# Altium project SMART_WATCH_TOP.PrjPcb
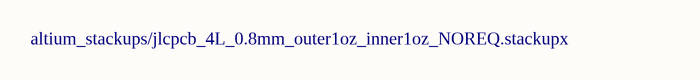
[diagram p0: specification.SchDoc]
11 sheets, 92 parts. Net scope: global (net labels, ports and power ports of the same name join across sheets).
Board file: WATCH.PcbDoc
Sheets:
  specification.SchDoc
  MAIN.SchDoc
    U_NRF24L01 = NRF24L01.SchDoc
    U_LCD = LCD.SchDoc
    U_button = button.SchDoc
    U_MPU_6050 = MPU_6050.SchDoc
    U_buzzer = buzzer.SchDoc
    U_GPIO_Expander = GPIO_Expander.SchDoc
    U_PWR = PWR.SchDoc
    U_mcu = mcu.SchDoc
    U_TOP_TO_BOTTOM_CONT = TOP_TO_BOTTOM_CONT.SchDoc

## Sheet specification.SchDoc
size A; SheetNumber: 5; SheetTotal: 5

### Notes on the sheet
- altium_stackups/jlcpcb_4L_0.8mm_outer1oz_inner1oz_NOREQ.stackupx

## Sheet MAIN.SchDoc
size A4; SheetNumber: 2; SheetTotal: 11
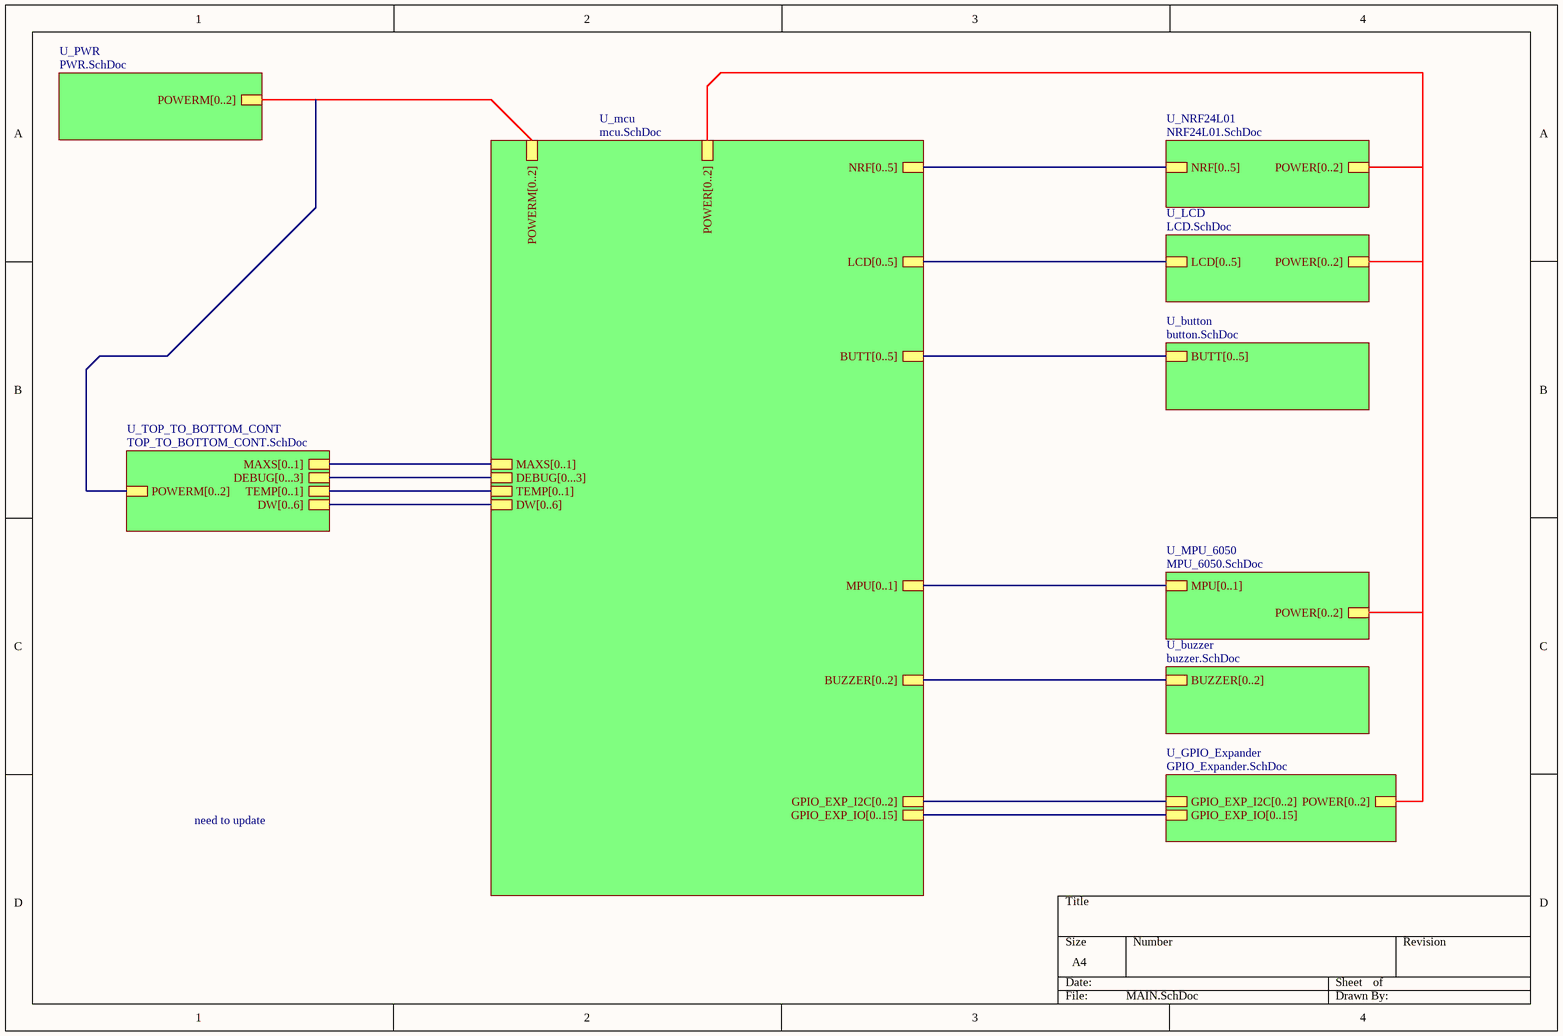
[diagram p1: MAIN.SchDoc]

### Sub-sheets
U_button = button.SchDoc: BUTT[0..5]
U_buzzer = buzzer.SchDoc: BUZZER[0..2]
U_GPIO_Expander = GPIO_Expander.SchDoc: POWER[0..2], GPIO_EXP_I2C[0..2], GPIO_EXP_IO[0..15]
U_LCD = LCD.SchDoc: POWER[0..2], LCD[0..5]
U_mcu = mcu.SchDoc: POWER[0..2], LCD[0..5], NRF[0..5], GPIO_EXP_I2C[0..2], MPU[0..1], BUZZER[0..2], GPIO_EXP_IO[0..15], BUTT[0..5], POWERM[0..2], MAXS[0..1], DEBUG[0...3], TEMP[0..1], DW[0..6]
U_MPU_6050 = MPU_6050.SchDoc: MPU[0..1], POWER[0..2]
U_NRF24L01 = NRF24L01.SchDoc: NRF[0..5], POWER[0..2]
U_PWR = PWR.SchDoc: POWERM[0..2]
U_TOP_TO_BOTTOM_CONT = TOP_TO_BOTTOM_CONT.SchDoc: MAXS[0..1], DW[0..6], TEMP[0..1], DEBUG[0...3], POWERM[0..2]

### Buses and harness runs
bus sheet U_button/BUTT[0..5] = sheet U_mcu/BUTT[0..5]
bus sheet U_buzzer/BUZZER[0..2] = sheet U_mcu/BUZZER[0..2]
bus sheet U_GPIO_Expander/GPIO_EXP_I2C[0..2] = sheet U_mcu/GPIO_EXP_I2C[0..2]
bus sheet U_GPIO_Expander/GPIO_EXP_IO[0..15] = sheet U_mcu/GPIO_EXP_IO[0..15]
bus sheet U_GPIO_Expander/POWER[0..2] = sheet U_LCD/POWER[0..2] = sheet U_mcu/POWER[0..2] = sheet U_MPU_6050/POWER[0..2] = sheet U_NRF24L01/POWER[0..2]
bus sheet U_LCD/LCD[0..5] = sheet U_mcu/LCD[0..5]
bus sheet U_mcu/DEBUG[0...3] = sheet U_TOP_TO_BOTTOM_CONT/DEBUG[0...3]
bus sheet U_mcu/DW[0..6] = sheet U_TOP_TO_BOTTOM_CONT/DW[0..6]
bus sheet U_mcu/MAXS[0..1] = sheet U_TOP_TO_BOTTOM_CONT/MAXS[0..1]
bus sheet U_mcu/MPU[0..1] = sheet U_MPU_6050/MPU[0..1]
bus sheet U_mcu/NRF[0..5] = sheet U_NRF24L01/NRF[0..5]
bus sheet U_mcu/POWERM[0..2] = sheet U_PWR/POWERM[0..2] = sheet U_TOP_TO_BOTTOM_CONT/POWERM[0..2]
bus sheet U_mcu/TEMP[0..1] = sheet U_TOP_TO_BOTTOM_CONT/TEMP[0..1]

### Notes on the sheet
- need to update

## Sheet NRF24L01.SchDoc
size A3; SheetNumber: 3; SheetTotal: 11
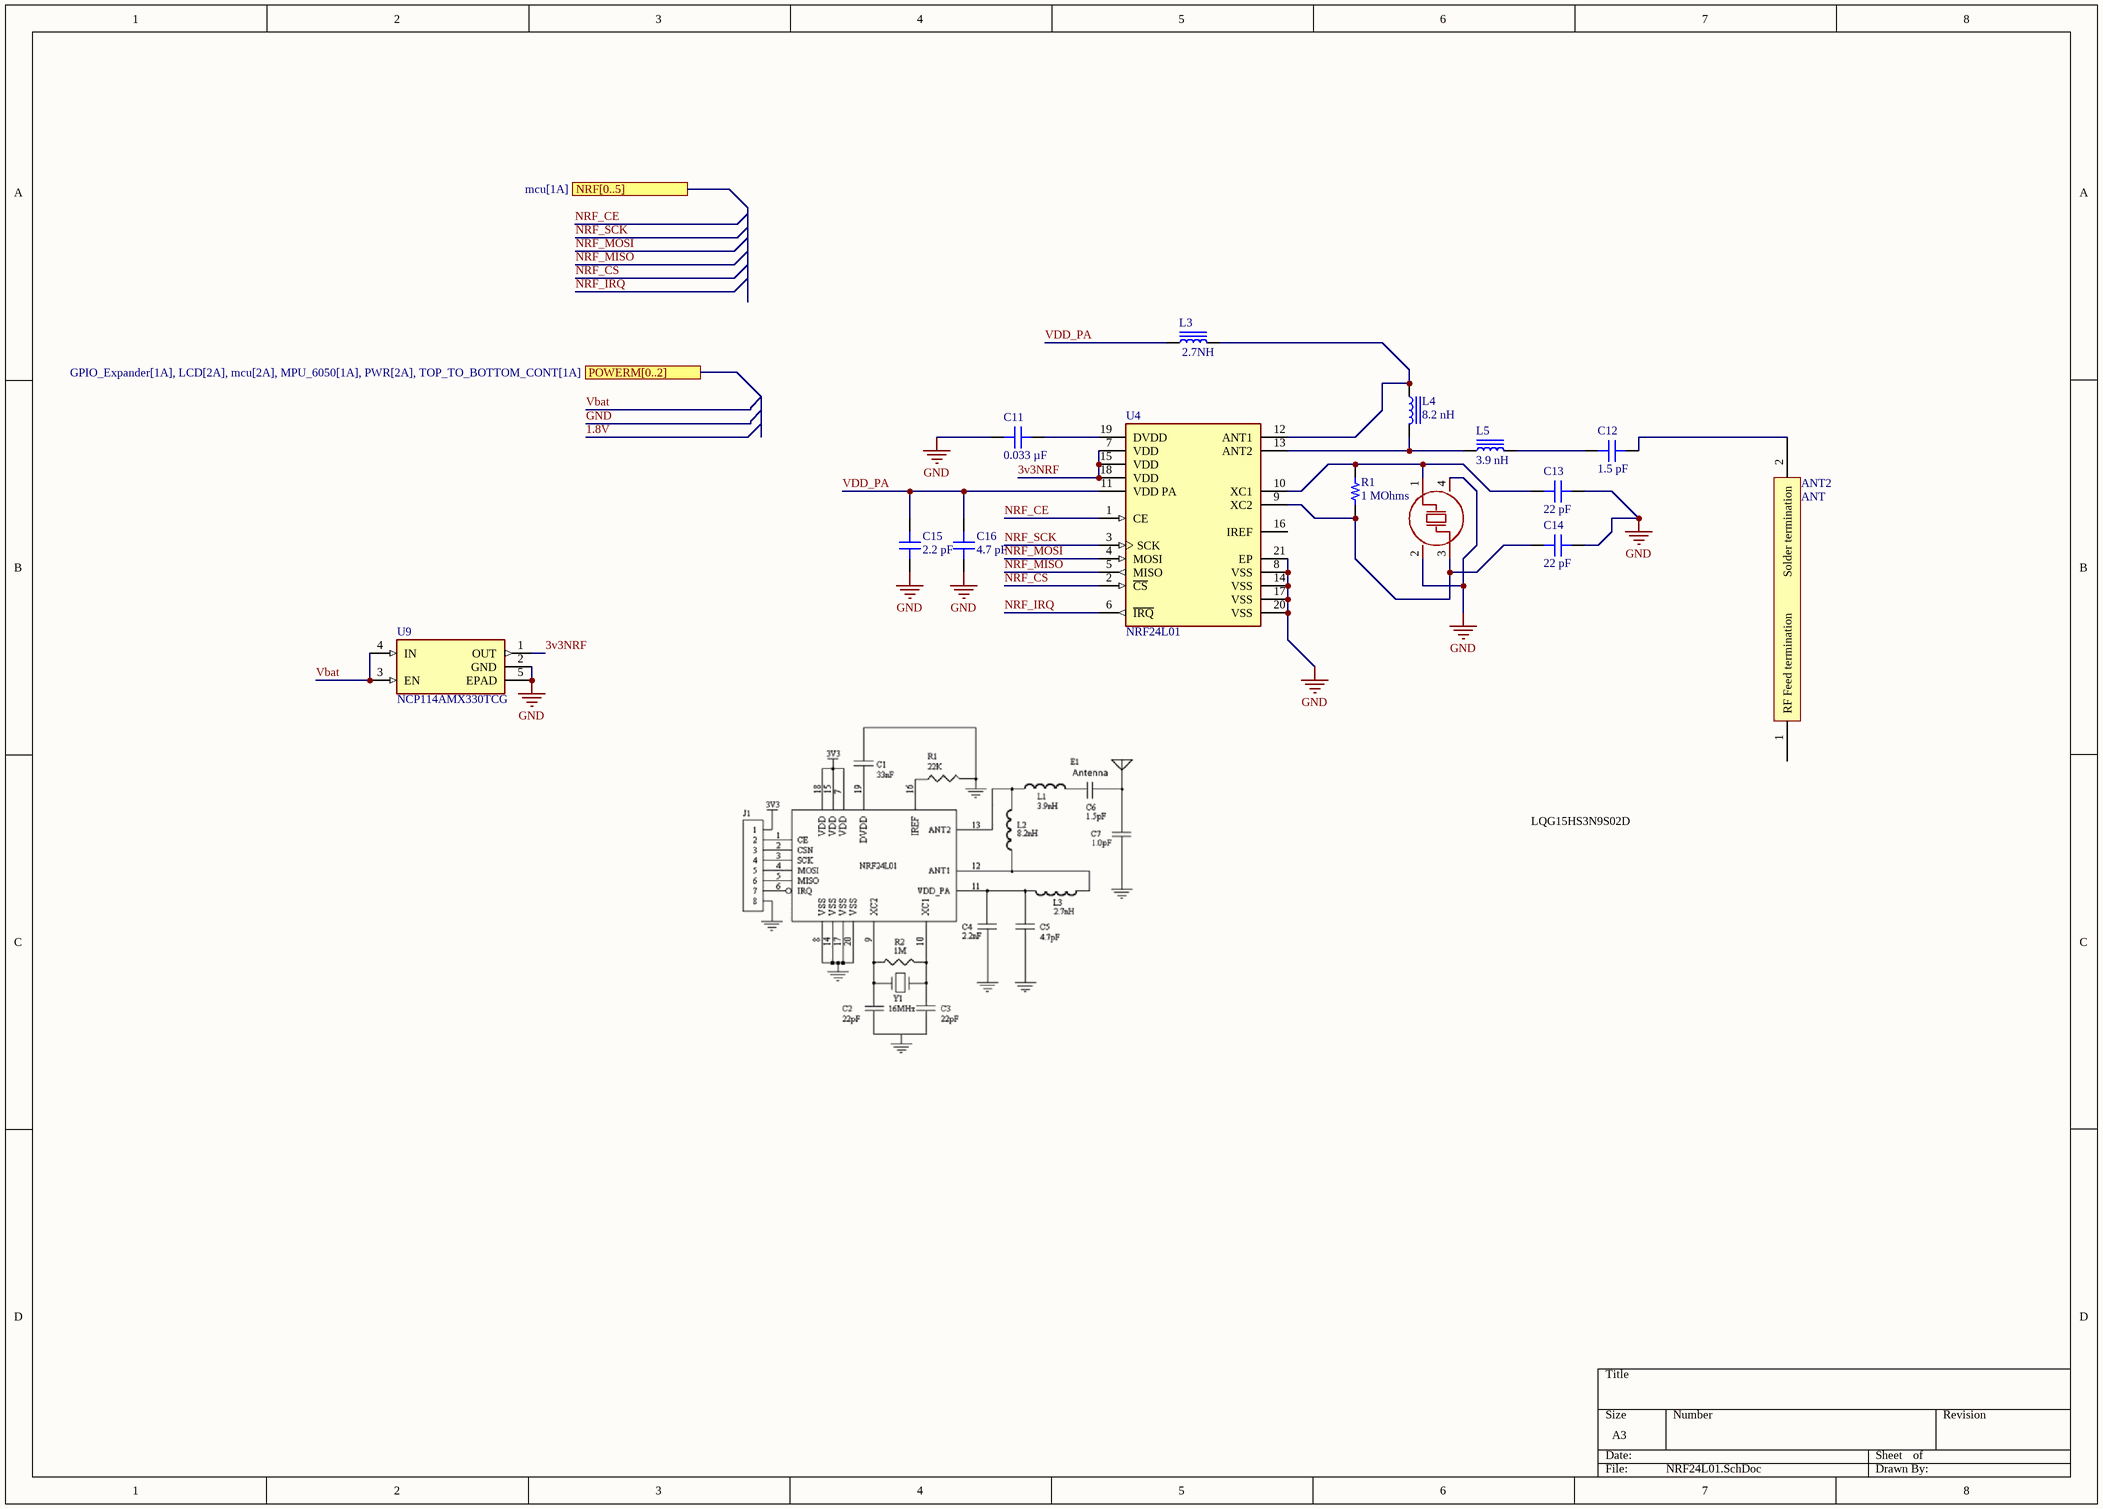
[diagram p2: NRF24L01.SchDoc]

### Parts
ANT2  ANT  [CAPC3216X13N]
C11  Capacitance: 0.033 µF  [CAP 0402_1005]
C12  Capacitance: 1.5 pF  [CAP 0402_1005]
C13  Capacitance: 22 pF  [CAP 0402_1005]
C14  Capacitance: 22 pF  [CAP 0402_1005]
C15  Capacitance: 2.2 pF  [CAP 0402_1005]
C16  Capacitance: 4.7 pF  [CAP 0402_1005]
L3  2.7NH  [IND 0402_1005 RF WW]
L4  8.2 nH  [Murata LQW15 0402]
L5  3.9 nH  [Murata LQW15 0402]
R1  1 MOhms  [RES 0402_1005]
U4  NRF24L01  [FP-NRF24L01-IPC_C]
U9  NCP114AMX330TCG  [REG_NCP114AMX330TCG]
X2  16MHz  [CRYSTAL-SMD_4P-L3.2-W2.5-BL]  (value not drawn)

### Ports
NRF[0..5] (see mcu[1A]), POWERM[0..2] (see GPIO_Expander[1A], LCD[2A], mcu[2A], MPU_6050[1A], PWR[2A], TOP_TO_BOTTOM_CONT[1A])

### Nets
GND: C11.1 C13.2 C14.2 C15.1 C16.1 U4.8(VSS) U4.14(VSS) U4.17(VSS) U4.20(VSS) U4.21(EP) U9.2(GND) U9.5(EPAD) X2.2 X2.4
3v3NRF: U4.7(VDD) U4.15(VDD) U4.18(VDD) U9.1(OUT)
NRF_CE: U4.1(CE)
NRF_CS: U4.2(~{CS})
NRF_IRQ: U4.6(~{IRQ})
NRF_MISO: U4.5(MISO)  [project net DW_MISO]
NRF_MOSI: U4.4(MOSI)  [project net DW_MOSI]
NRF_SCK: U4.3(SCK)  [project net DW_SPI_CLK]
Vbat: U9.3(EN) U9.4(IN)
VDD_PA: C15.2 C16.2 L3.1 U4.11(VDD_PA)
NetANT2_2: ANT2.2(Solder_termination) C12.2
NetC11_2: C11.2 U4.19(DVDD)
NetC12_1: C12.1 L5.2
NetC13_1: C13.1 R1.2 U4.10(XC1) X2.1(OSC1)
NetC14_1: C14.1 R1.1 U4.9(XC2) X2.3(OSC2)
NetL3_2: L3.2 L4.1 U4.12(ANT1)
NetL4_2: L4.2 L5.1 U4.13(ANT2)

Not connected (* = marked no-connect by the designer): ANT2 1(RF_Feed_termination); U4 16(IREF)

### Notes on the sheet
- LQG15HS3N9S02D

### Library data of the parts
ANT2 = ANT: MFR.Part #: 2450AT18D0100E; Manufacturer: Johanson Dielectrics; JLCPCB Part #: C2917718
C11 = 0402B333K100CT: CAP CER 0.033UF 10V X7R 0402; MFR.Part #: 0402B333K160NT; Manufacturer: FH (Guangdong Fenghua Advanced Tech); JLCPCB Part #: C60425
C12 = 251R07S1R5AV4T: CAP CER 1.5PF 250V C0G/NP0 0402; MFR.Part #: 0402CG1R5C500NT; Manufacturer: FH (Guangdong Fenghua Advanced Tech); JLCPCB Part #: C1552
C13 C14 = 201R07S220GV4T: CAP CER 22PF 200V C0G/NP0 0402; MFR.Part #: 0402CG220J500NT; Manufacturer: FH (Guangdong Fenghua Advanced Tech); Voltage - Rated: 200V; JLCPCB Part #: C1555
C15 = 251R07S2R2AV4T: CAP CER 2.2PF 250V C0G/NP0 0402; MFR.Part #: C1559; Manufacturer: FH (Guangdong Fenghua Advanced Tech); JLCPCB Part #: 0402CG2R2C500NT
C16 = 201R07S4R7AV4T: CAP CER 4.7PF 200V C0G/NP0 0402; MFR.Part #: 0402CG4R7C500NT; Manufacturer: FH (Guangdong Fenghua Advanced Tech); JLCPCB Part #: C1569
L3 = 744765027A: FIXED IND 2.7NH 640MA 120MOHM SM; MFR.Part #: CS0402-2N7B-S; Manufacturer: Chilisin Elec; ComponentLink1Description: Datasheet; ComponentLink1URL: https://katalog.we-online.de/pbs/datasheet/744765027A.pdf; ComponentLink2Description: DigiKey Link; ComponentLink2URL: https://www.digikey.com/en/products/detail/würth-elektronik/744765027A/1994078; JLCPCB Part #: C142182; Value: 2.7NH
L4 = LQW15AN8N2J8ZD: FIXED IND 8.2NH 1.5A 0.069OHM SM; MFR.Part #: LQW15AN8N2G80D; Manufacturer: Murata Electronics; ComponentLink1Description: Datasheet; ComponentLink1URL: https://search.murata.co.jp/Ceramy/image/img/P02/JELF243A-9138.pdf; ComponentLink2Description: DigiKey Link; ComponentLink2URL: https://www.digikey.com/en/products/detail/murata-electronics/LQW15AN8N2J8ZD/6799017; Value: 8.2 nH; JLCPCB Part #: C307610
L5 = LQW15AN3N9D10D: FIXED IND 3.9NH 900MA 0.04OHM SM; MFR.Part #: LQG15HS3N9S02D; Manufacturer: Murata Electronics; ComponentLink1Description: Datasheet; ComponentLink1URL: https://search.murata.co.jp/Ceramy/image/img/P02/JELF243A-0051.pdf; ComponentLink2Description: DigiKey Link; ComponentLink2URL: https://www.digikey.com/en/products/detail/murata-electronics/LQW15AN3N9D10D/2594912; Value: 3.9 nH; JLCPCB Part #: C77109
R1 = MCS04020C1004FE000: RES SMD 1M OHM 1% 1/10W 0402; Manufacturer: UNI-ROYAL(Uniroyal Elec); MFR.Part #: 0402WGF1004TCE; Value: 1 MOhms; ComponentLink1Description: Datasheet; ComponentLink1URL: http://www.vishay.com/docs/28705/mcx0x0xpro.pdf; ComponentLink2Description: DigiKey Link; ComponentLink2URL: http://digikey.com/product-detail/en/vishay-beyschlag/MCS04020C1004FE000/MCS0402-1.00M-CFCT-ND/2607931; JLCPCB Part #: C26083
U4 = CMP-228436-000003-1: IC RF TXRX ISM>1GHZ 20VFQFN; MFR.Part #: NRF24L01P-R; Manufacturer: Nordic Semicon; JLCPCB Part #: C8791
U9 = NCP114AMX330TCG: Linear Voltage Regulator IC Positive Fixed 1 Output 300mA 4-UDFN (1.0x1.0); Manufacturer: onsemi; JLCPCB Part #: C133056; MFR.Part #: NCP114AMX330TCG
X2 = ABM8G-16.000MHZ-18-D2Y-T: Manufacturer: Abracon LLC; MFR.Part #: ABM8G-16.000MHZ-18-D2Y-T; JLCPCB Part #: C1985423

## Sheet LCD.SchDoc
size A; SheetNumber: 4; SheetTotal: 11
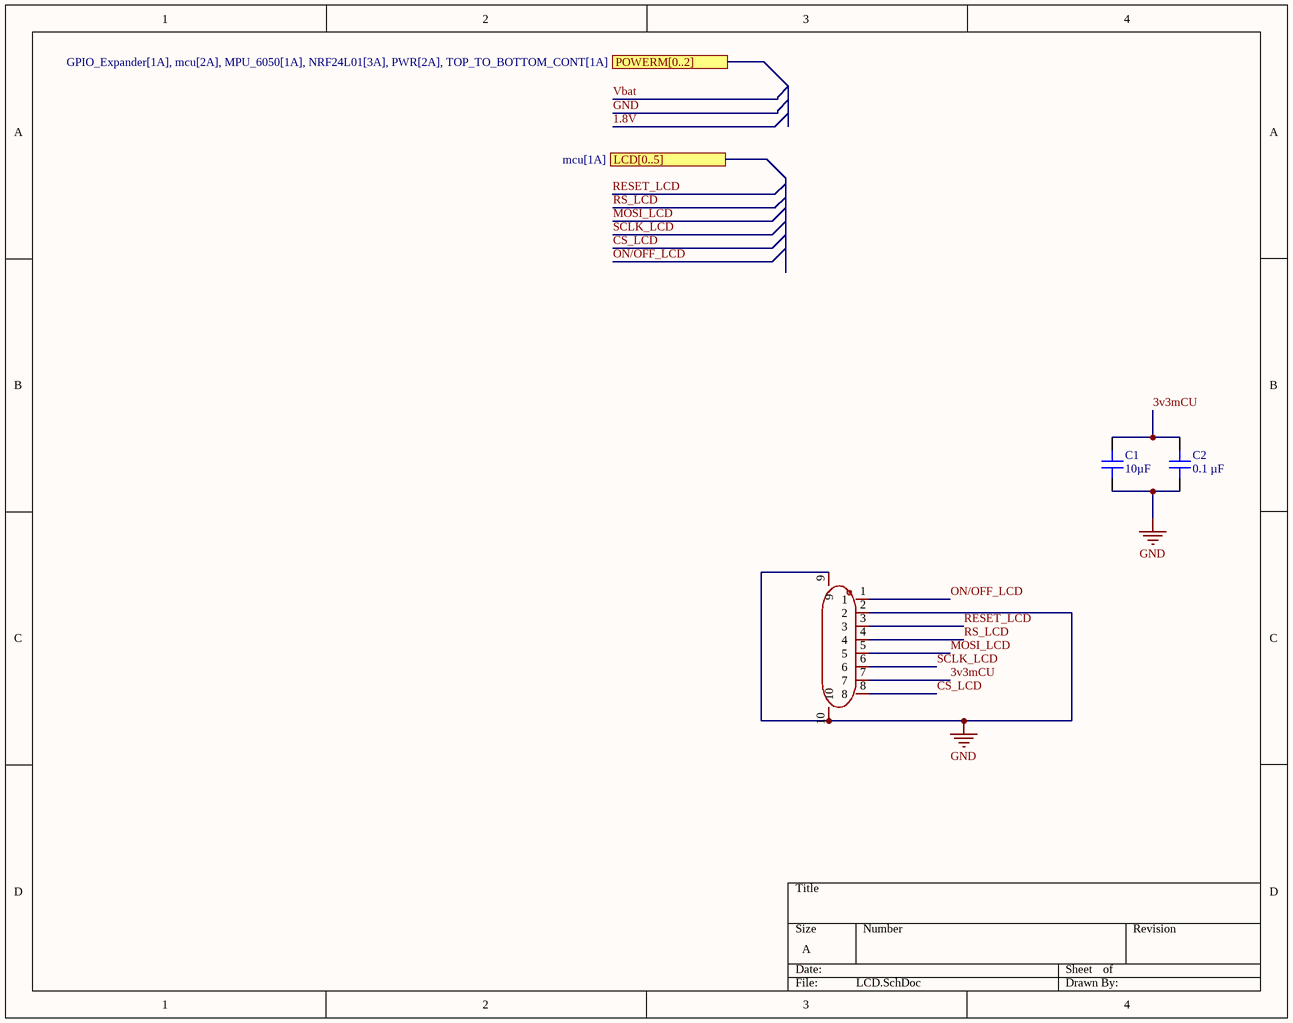
[diagram p3: LCD.SchDoc]

### Parts
C1  Capacitance: 10µF  [CAP 0402_1005]
C2  Capacitance: 0.1 µF  [CAP 0402_1005]
FPC1  AFC04-S08ECA-00  [FPC-SMD_AFC04-S08ECA-00]  (value not drawn)

### Ports
LCD[0..5] (see mcu[1A]), POWERM[0..2] (see GPIO_Expander[1A], mcu[2A], MPU_6050[1A], NRF24L01[3A], PWR[2A], TOP_TO_BOTTOM_CONT[1A])

### Nets
GND: C1.1 C2.1 FPC1.2 FPC1.9 FPC1.10
3v3mCU: C1.2 C2.2 FPC1.7
CS_LCD: FPC1.8
MOSI_LCD: FPC1.5  [project net DW_MOSI]
ON/OFF_LCD: FPC1.1
RESET_LCD: FPC1.3
RS_LCD: FPC1.4
SCLK_LCD: FPC1.6  [project net DW_SPI_CLK]

### Library data of the parts
C1 = 0402ZD106MAT2A: CAP CER 10UF 10V X5R 0402; MFR.Part #: CL05A106MP8NUB8; Manufacturer: Samsung Electro-Mechanics; JLCPCB Part #: C307415
C2 = MD0402BB104K100NGHT-EM: CAP CER 0.1UF 10V X7R 0402; MFR.Part #: GRM155R71A104KA01D; Manufacturer: Murata Electronics; JLCPCB Part #: C71687
FPC1 = AFC04-S08ECA-00: Manufacturer: JUSHUO; JLCPCB Part #: C883637; MFR.Part #: AFC04-S08ECA-00

## Sheet button.SchDoc
size A4; SheetNumber: 10; SheetTotal: 11
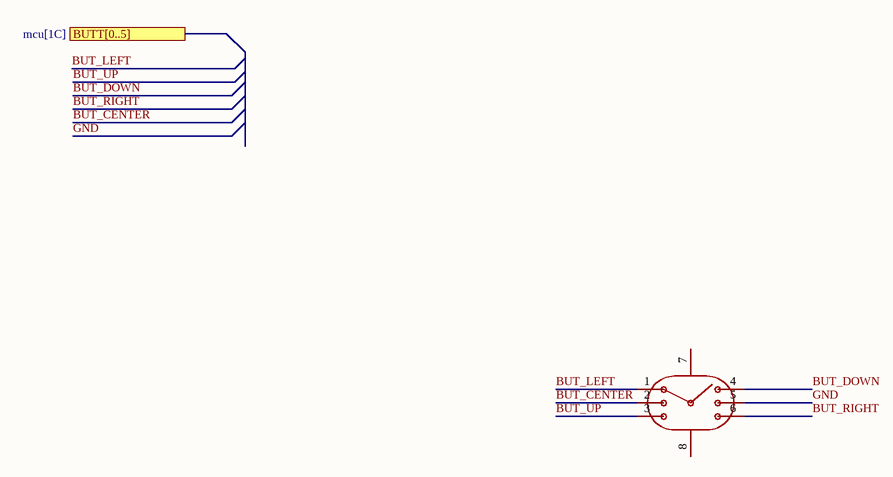
[diagram p4: button.SchDoc]

### Parts
SW1  K1-5202UA-01  [SW-SMD_K1-5202UA-01]  (value not drawn)

### Ports
BUTT[0..5] (see mcu[1C])

### Nets
GND: SW1.5(D)
BUT_CENTER: SW1.2(B)
BUT_DOWN: SW1.4(CENTER)
BUT_LEFT: SW1.1(A)
BUT_RIGHT: SW1.6(COMMON)
BUT_UP: SW1.3(C)

Not connected (* = marked no-connect by the designer): SW1 7(COMMON) 8(COMMON)

### Library data of the parts
SW1 = K1-5202UA-01: Manufacturer: Korean Hroparts Elec; MFR.Part #: K1-5202UA-01; JLCPCB Part #: C136710

## Sheet MPU_6050.SchDoc
size A; SheetNumber: 8; SheetTotal: 11
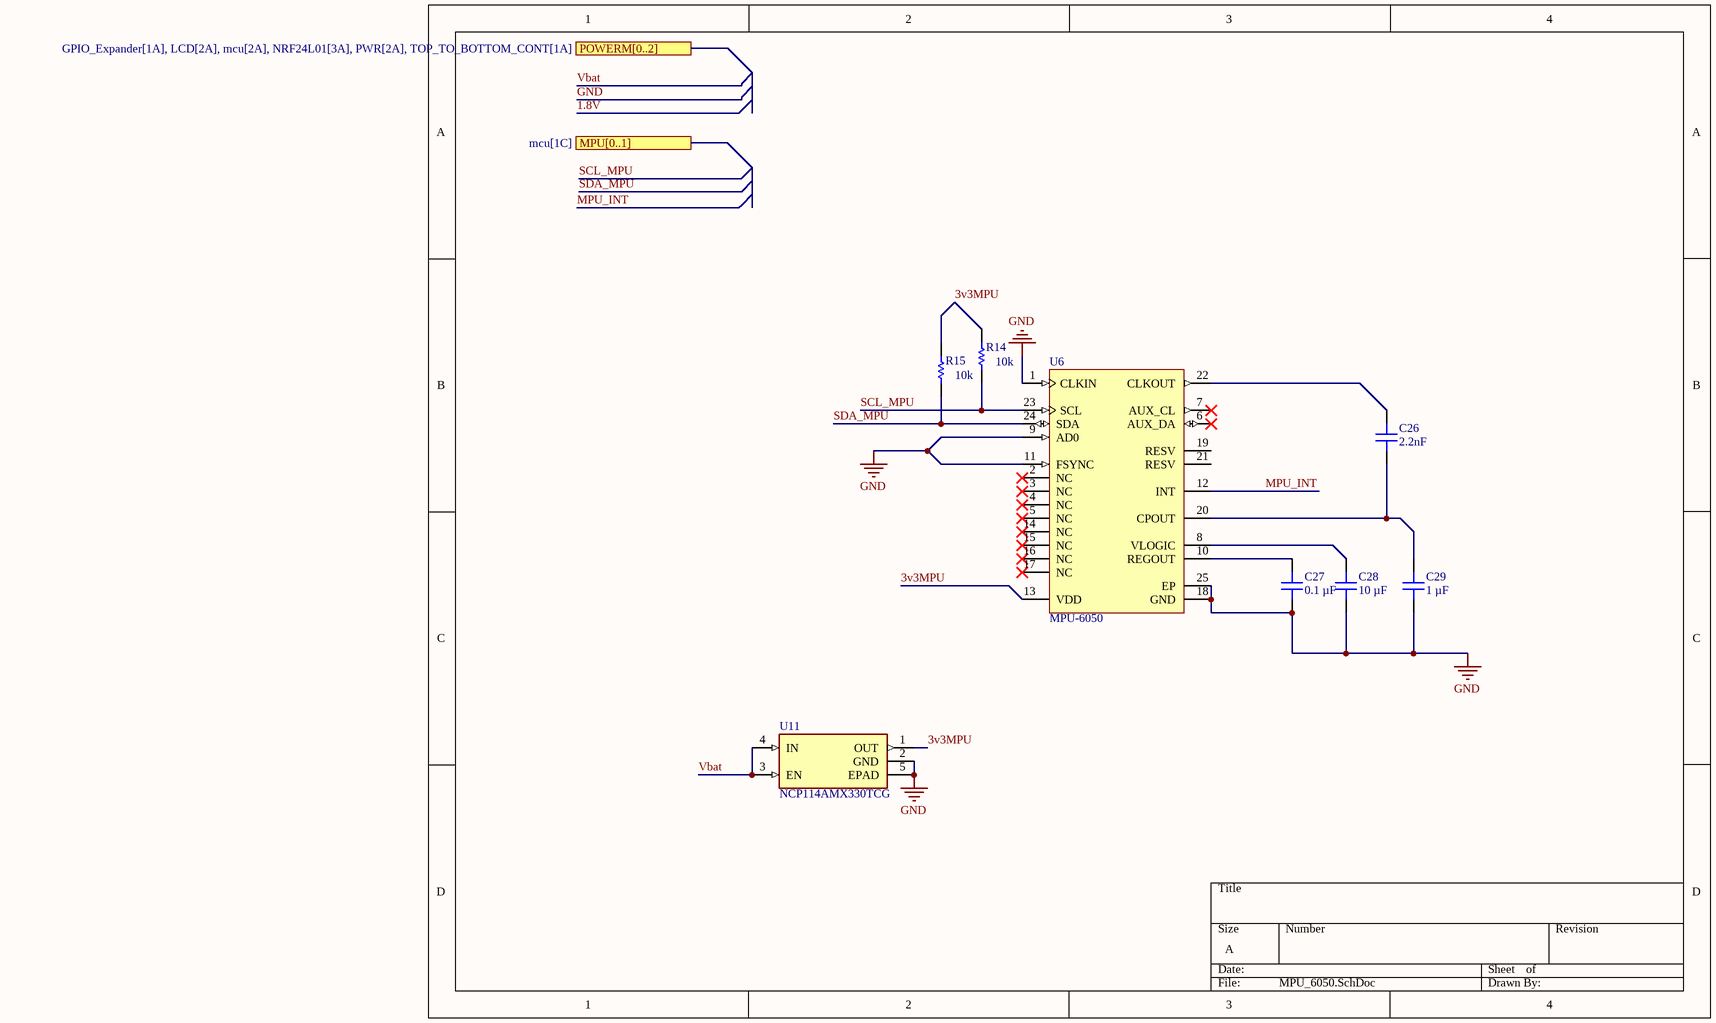
[diagram p5: MPU_6050.SchDoc]

### Parts
C26  Capacitance: 2.2nF  [CAP 0402_1005]
C27  Capacitance: 0.1 µF  [CAP 0402_1005]
C28  Capacitance: 10 µF  [CAP 0402_1005]
C29  Capacitance: 1 µF  [CAP 0402_1005]
R14  resistance: 10k  [RESC1005X40X25LL05T10]  (hidden comment: 0402WGF1002TCE)
R15  resistance: 10k  [RESC1005X40X25LL05T10]  (hidden comment: 0402WGF1002TCE)
U6  MPU-6050  [IS-QFN-24_V]
U11  NCP114AMX330TCG  [REG_NCP114AMX330TCG]

### Ports
MPU[0..1] (see mcu[1C]), POWERM[0..2] (see GPIO_Expander[1A], LCD[2A], mcu[2A], NRF24L01[3A], PWR[2A], TOP_TO_BOTTOM_CONT[1A])

### Nets
GND: C27.1 C28.1 C29.1 U6.1(CLKIN) U6.9(AD0) U6.11(FSYNC) U6.18(GND) U6.25(EP) U11.2(GND) U11.5(EPAD)
3v3MPU: R14.2 R15.2 U6.13(VDD) U11.1(OUT)
MPU_INT: U6.12(INT)
SCL_MPU: R14.1 U6.23(SCL)  [project net MAXS_SCL]
SDA_MPU: R15.1 U6.24(SDA)  [project net MAXS_SDA]
Vbat: U11.3(EN) U11.4(IN)
NetC26_1: C26.1 C29.2 U6.20(CPOUT)
NetC26_2: C26.2 U6.22(CLKOUT)
NetC27_2: C27.2 U6.10(REGOUT)
NetC28_2: C28.2 U6.8(VLOGIC)

Not connected (* = marked no-connect by the designer): U6 2(NC)* 3(NC)* 4(NC)* 5(NC)* 6(AUX_DA)* 7(AUX_CL)* 14(NC)* 15(NC)* 16(NC)* 17(NC)* 19(RESV) 21(RESV)

### Library data of the parts
C26 C29 = 0402DD105KAT2A: 10V 1uF X5R ±10% 0402 Multilayer Ceramic Capacitors MLCC - SMD/SMT ROHS; Manufacturer: Samsung Electro-Mechanics; MFR.Part #: CL05A105KP5NNNC; JLCPCB Part #: C14445
C27 = 0402B104J160CT: 100nF 16V X7R ±10% 0402 Multilayer Ceramic Capacitors MLCC - SMD/SMT ROHS; Manufacturer: YAGEO; MFR.Part #: CC0402KRX7R7BB104; JLCPCB Part #: C60474
C28 = 0402DD105KAT2A: 10V 1uF X5R ±10% 0402 Multilayer Ceramic Capacitors MLCC - SMD/SMT ROHS; Manufacturer: Samsung Electro-Mechanics; MFR.Part #: CL05A106MQ5NUNC; JLCPCB Part #: C15525
R14 R15 = CMP-2002-03043-1: Manufacturer: UNI-ROYAL(Uniroyal Elec); JLCPCB Part #: C25744; MFR.Part #: 0402WGF1002TCE
U6 = CMP-1753-00002-2: 3-Axis Gyroscope, Accelerometer and a Digital Motion Processor(TM) (DMP), 2.375 to 3.46 V, -40 to 85 degC, 24-Pin QFN, RoHS, Tape and Reel; Manufacturer: TDK InvenSense; MFR.Part #: MPU-6050; JLCPCB Part #: C24112
U11 = NCP114AMX330TCG: as U9 on sheet NRF24L01; MFR.Part #: NCP114AMX330TCG; JLCPCB Part #: C133056

## Sheet buzzer.SchDoc
size A4; SheetNumber: 11; SheetTotal: 11
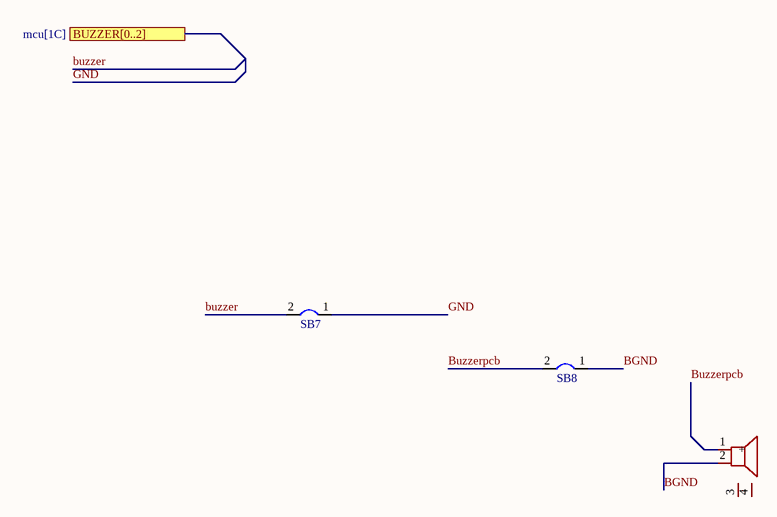
[diagram p6: buzzer.SchDoc]

### Parts
BUZZER1  2.7kHz  [BUZ-SMD_4P-L8.5-W8.5-P8.50-TL]  (value not drawn)
SB7  Jumper  [Jumper]  (value not drawn)
SB8  Jumper  [Jumper]  (value not drawn)

### Ports
BUZZER[0..2] (see mcu[1C])

### Nets
GND: SB7.1
BGND: BUZZER1.2 SB8.1
buzzer: SB7.2
Buzzerpcb: BUZZER1.1(+) SB8.2

Not connected (* = marked no-connect by the designer): BUZZER1 3(NC) 4(NC)

### Library data of the parts
BUZZER1 = MLT-8540: Manufacturer: Jiangsu Huaneng Elec; MFR.Part #: MLT-8540; JLCPCB Part #: C95300

## Sheet GPIO_Expander.SchDoc
size A; SheetNumber: 6; SheetTotal: 11
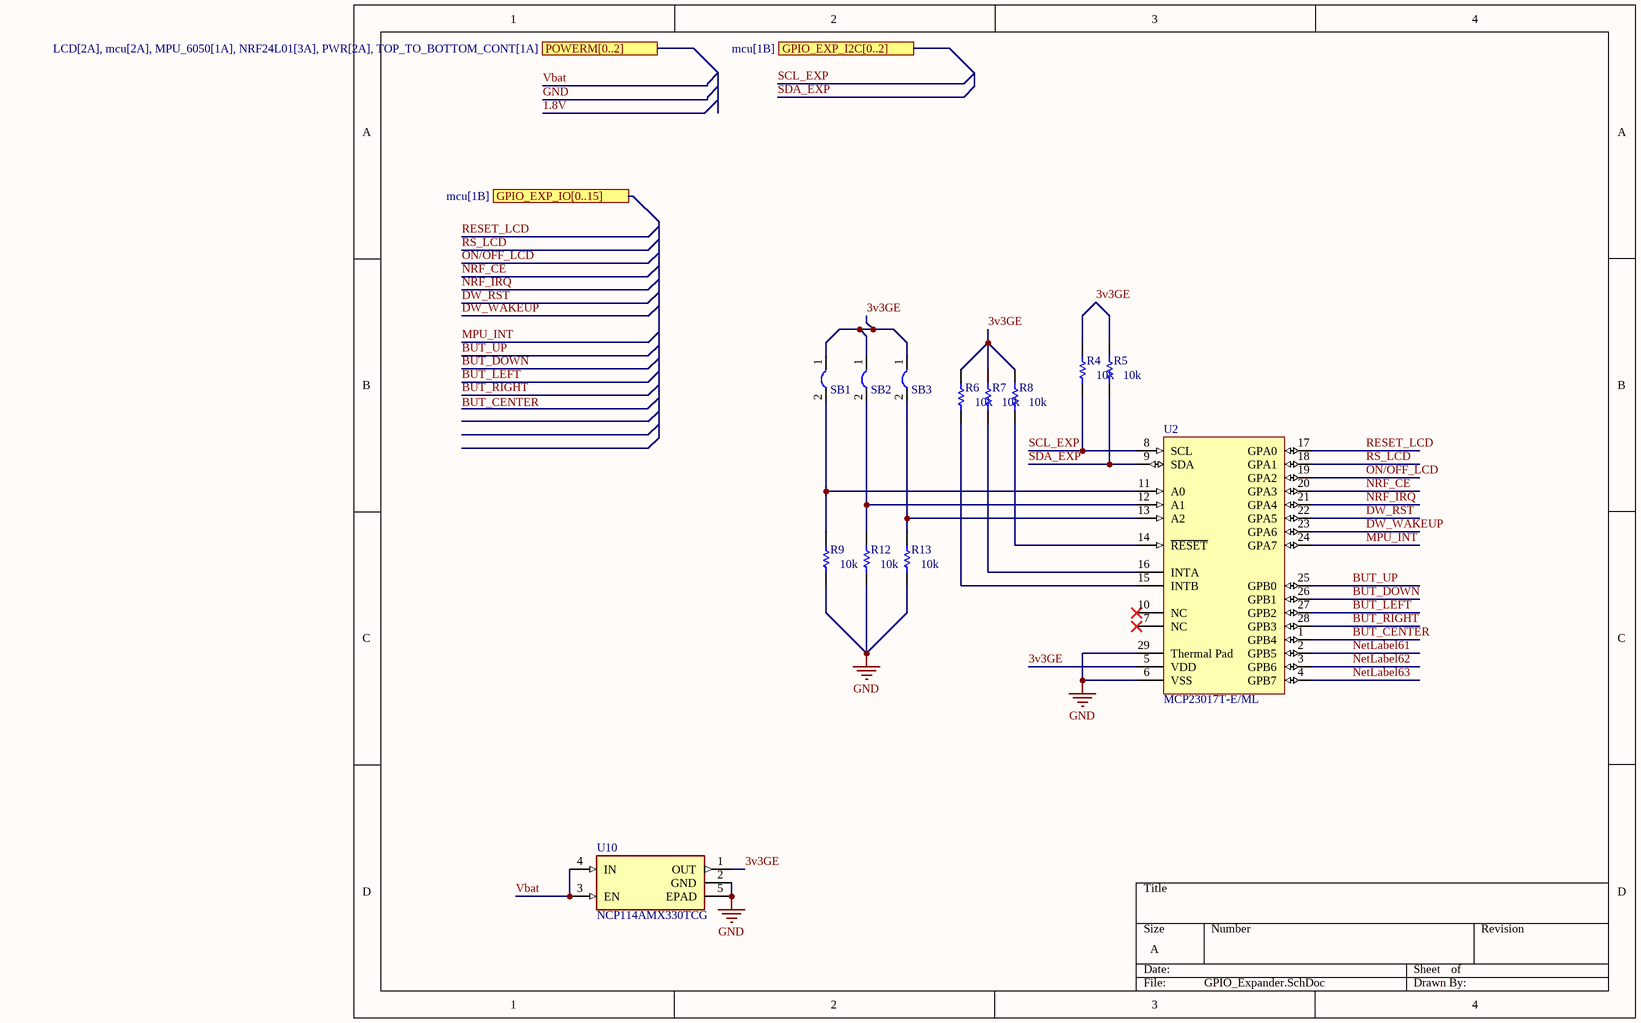
[diagram p7: GPIO_Expander.SchDoc]

### Parts
R4  resistance: 10k  [RESC1005X40X25LL05T10]  (hidden comment: 0402WGF1002TCE)
R5  resistance: 10k  [RESC1005X40X25LL05T10]  (hidden comment: 0402WGF1002TCE)
R6  resistance: 10k  [RESC1005X40X25LL05T10]  (hidden comment: 0402WGF1002TCE)
R7  resistance: 10k  [RESC1005X40X25LL05T10]  (hidden comment: 0402WGF1002TCE)
R8  resistance: 10k  [RESC1005X40X25LL05T10]  (hidden comment: 0402WGF1002TCE)
R9  resistance: 10k  [RESC1005X40X25LL05T10]  (hidden comment: 0402WGF1002TCE)
R12  resistance: 10k  [RESC1005X40X25LL05T10]  (hidden comment: 0402WGF1002TCE)
R13  resistance: 10k  [RESC1005X40X25LL05T10]  (hidden comment: 0402WGF1002TCE)
SB1  Jumper  [Jumper]  (value not drawn)
SB2  Jumper  [Jumper]  (value not drawn)
SB3  Jumper  [Jumper]  (value not drawn)
U2  MCP23017T-E/ML  [QFN-ML28_M]
U10  NCP114AMX330TCG  [REG_NCP114AMX330TCG]

### Ports
GPIO_EXP_I2C[0..2] (see mcu[1B]), GPIO_EXP_IO[0..15] (see mcu[1B]), POWERM[0..2] (see LCD[2A], mcu[2A], MPU_6050[1A], NRF24L01[3A], PWR[2A], TOP_TO_BOTTOM_CONT[1A])

### Nets
GND: R9.1 R12.1 R13.1 U2.6(VSS) U2.29(Thermal_Pad) U10.2(GND) U10.5(EPAD)
3v3GE: R4.2 R5.2 R6.2 R7.2 R8.2 SB1.1 SB2.1 SB3.1 U2.5(VDD) U10.1(OUT)
BUT_CENTER: U2.1(GPB4)
BUT_DOWN: U2.26(GPB1)
BUT_LEFT: U2.27(GPB2)
BUT_RIGHT: U2.28(GPB3)
BUT_UP: U2.25(GPB0)
DW_RST: U2.22(GPA5)
DW_WAKEUP: U2.23(GPA6)
MPU_INT: U2.24(GPA7)
NetLabel61: U2.2(GPB5)
NetLabel62: U2.3(GPB6)
NetLabel63: U2.4(GPB7)
NRF_CE: U2.20(GPA3)
NRF_IRQ: U2.21(GPA4)
ON/OFF_LCD: U2.19(GPA2)
RESET_LCD: U2.17(GPA0)
RS_LCD: U2.18(GPA1)
SCL_EXP: R4.1 U2.8(SCL)
SDA_EXP: R5.1 U2.9(SDA)
Vbat: U10.3(EN) U10.4(IN)
NetR6_1: R6.1 U2.15(INTB)
NetR7_1: R7.1 U2.16(INTA)
NetR8_1: R8.1 U2.14(~{RESET})
NetR9_2: R9.2 SB1.2 U2.11(A0)
NetR12_2: R12.2 SB2.2 U2.12(A1)
NetR13_2: R13.2 SB3.2 U2.13(A2)

Not connected (* = marked no-connect by the designer): U2 7(NC)* 10(NC)*

### Notes on the sheet
- Labels drawn without touching a wire or pin: BUT_CENTER

### Library data of the parts
R4-R9 R12 R13 = CMP-2002-03043-1: Manufacturer: UNI-ROYAL(Uniroyal Elec); JLCPCB Part #: C25744; MFR.Part #: 0402WGF1002TCE
U2 = CMP-0186-00119-2: 16-Bit I/O Expander with Serial Interface, 28-Pin QFN, Extended Temperature, Tape and Reel; Manufacturer: Microchip Tech; ComponentLink3Description: Package Specification; ComponentLink2URL: http://ww1.microchip.com/downloads/en/DeviceDoc/21952b.pdf; ComponentLink2Description: Datasheet; ComponentLink1URL: http://www.microchip.com/; ComponentLink3URL: http://www.microchip.com/stellent/groups/techpub_sg/documents/packagingspec/en012702.pdf; ComponentLink1Description: Manufacturer URL; JLCPCB Part #: C629439; MFR.Part #: MCP23017T-E/ML
U10 = NCP114AMX330TCG: as U9 on sheet NRF24L01; MFR.Part #: NCP114AMX330TCG; JLCPCB Part #: C133056

## Sheet PWR.SchDoc
size A3; SheetNumber: 9; SheetTotal: 11
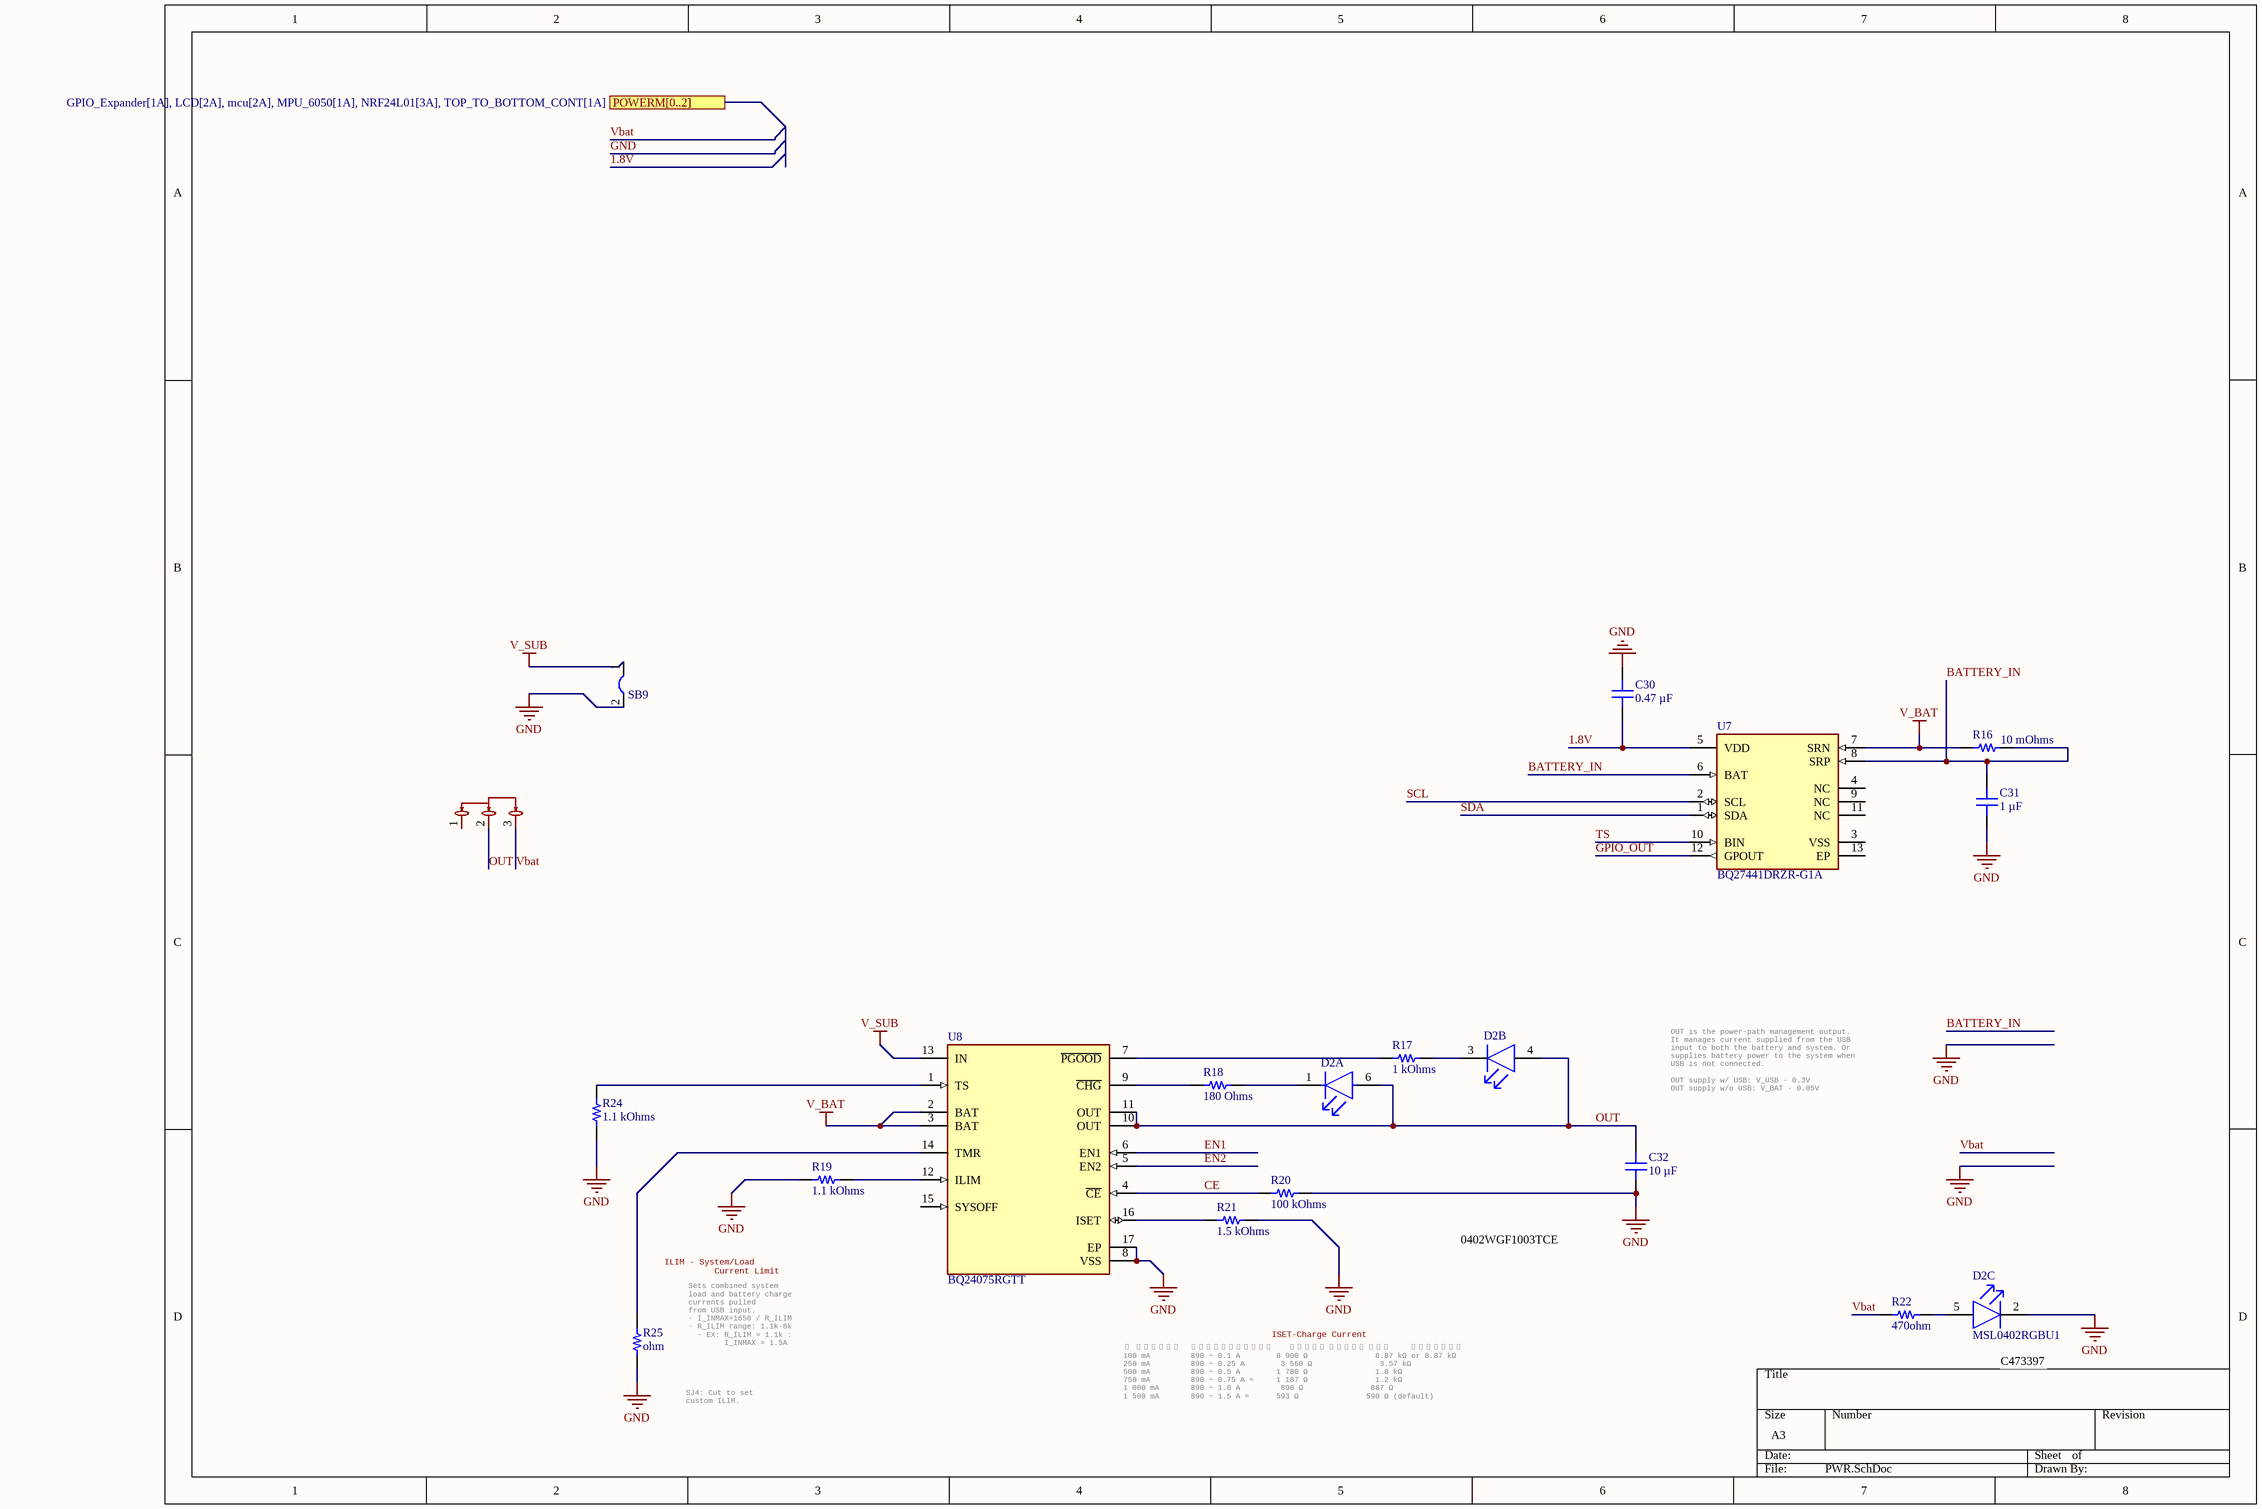
[diagram p8: PWR.SchDoc]

### Parts
C30  Capacitance: 0.47 µF  [CAP 0402_1005]
C31  Capacitance: 1 µF  [MURATA GRM155 0402_1005]
C32  10 µF  [CAP 0402_1005]
D2  MSL0402RGBU1  [FP-MSL0402-MFG]  (value not drawn)  (parts A,B,C of 3)
R16  10 mOhms  [RES 0402_1005]
R17  1 kOhms  [RES 0402_1005]
R18  180 Ohms  [YAGEO RES 0402_1005]
R19  1.1 kOhms  [YAGEO RES 0402_1005]
R20  100 kOhms  [RES 0402_1005]
R21  1.5 kOhms  [RES 0402_1005]
R22  470ohm  [RES 0402_1005]
R24  1.1 kOhms  [YAGEO RES 0402_1005]
R25  ohm  [YAGEO RES 0402_1005]
SB9  Jumper  [Jumper]  (value not drawn)
SW2  MST-12D18G4 SPDT Slide Switch  [SW-SMD_MST-12D18G4-SPDT-SLIDE-SWITCH]  (value not drawn)
U7  BQ27441DRZR-G1A  [FP-DRZ0012A-MFG]
U8  BQ24075RGTT  [FP-RGT0016C-IPC_C]

### Ports
POWERM[0..2] (see GPIO_Expander[1A], LCD[2A], mcu[2A], MPU_6050[1A], NRF24L01[3A], TOP_TO_BOTTOM_CONT[1A])

### Nets
GND: C30.1 C31.1 C32.1 D2.2(GREEN_C) R19.1 R20.1 R21.2 R24.1 R25.1 SB9.2 U8.8(VSS) U8.17(EP)
V_BAT: R16.1 U7.7(SRN) U8.2(BAT) U8.3(BAT)
V_SUB: SB9.1 U8.13(IN)
1.8V: C30.2 U7.5(VDD)
BATTERY_IN: C31.2 R16.2 U7.6(BAT) U7.8(SRP)
CE: R20.2 U8.4(~{CE})
EN1: U8.6(EN1)
EN2: U8.5(EN2)
GPIO_OUT: U7.12(GPOUT)
OUT: C32.2 D2.4(RED_A) D2.6(BLUE_A) SW2.2 U8.10(OUT) U8.11(OUT)
SCL: U7.2(SCL)  [project net MAXS_SCL]
SDA: U7.1(SDA)  [project net MAXS_SDA]
TS: U7.10(BIN)
Vbat: R22.1 SW2.3
NetD2_1: D2.1(BLUE_C) R18.1
NetD2_3: D2.3(RED_C) R17.2
NetD2_5: D2.5(GREEN_A) R22.2
NetR17_1: R17.1 U8.7(~{PGOOD})
NetR18_2: R18.2 U8.9(~{CHG})
NetR19_2: R19.2 U8.12(ILIM)
NetR21_1: R21.1 U8.16(ISET)
NetR24_2: R24.2 U8.1(TS)
NetR25_2: R25.2 U8.14(TMR)

Not connected (* = marked no-connect by the designer): SW2 1; U7 3(VSS) 4(NC) 9(NC) 11(NC) 13(EP); U8 15(SYSOFF)

### Notes on the sheet
- OUT is the power-path management output.
  It manages current supplied from the USB
  input to both the battery and system. Or
  supplies battery power to the system when
  USB is not connected.
  OUT supply w/ USB: V_USB - 0.3V
  OUT supply w/o USB: V_BAT - 0.05V
- 0402WGF1003TCE
- ILIM - System/Load
  Current Limit
- ISET-Charge Current
- (near R25) Sets combined system
  load and battery charge
  currents pulled
  from USB input.
  - I_INMAX=1650 / R_ILIM
  - R_ILIM range: 1.1k-8k
  - EX: R_ILIM = 1.1k :
  I_INMAX = 1.5A
- (near D2) C473397
- SJ4: Cut to set
  custom ILIM.
- I  CHARGE     Calculation	       𝑅𝐼𝑆𝐸𝑇 RISET (Ω)          R_Value
  100 mA	        890 ÷ 0.1 A	       8 900 Ω	              8.87 kΩ or 8.87 kΩ
  250 mA	        890 ÷ 0.25 A	       3 560 Ω	              3.57 kΩ
  500 mA	        890 ÷ 0.5 A	       1 780 Ω	              1.8 kΩ
  750 mA	        890 ÷ 0.75 A	≈     1 187 Ω	              1.2 kΩ
  1 000 mA       890 ÷ 1.0 A	        890 Ω	              887 Ω
  1 500 mA       890 ÷ 1.5 A	≈      593 Ω	              590 Ω (default)

### Library data of the parts
C30 = C1005X5R1V474K050BE: CAP CER 0.47UF 35V X5R 0402; MFR.Part #: GRM155R61A474KE15D; Manufacturer: Murata Electronics; JLCPCB Part #: C77003
C31 = GRM155C71A105KE11D: CAP CER 1UF 10V X7S 0402; MFR.Part #: GRM155R60J105KE19D; Manufacturer: Murata Electronics; JLCPCB Part #: C15684
C32 = CL05A106MP8NUB8: CAP CER 10UF 10V X5R 0402; MFR.Part #: CL05A106MQ5NUNC; Manufacturer: Samsung Electro-Mechanics; Capacitance: 10 µF; JLCPCB Part #: C15525
D2 = CMP-08952-000010-1: LED RGB DIFFUSED 1816 SMD; ComponentLink2Description: Datasheet; ComponentLink2URL: https://d1d2qsbl8m0m72.cloudfront.net/en/products/databook/datasheet/opto/led/chip_multi/msl0402rgb-e.pdf; Device Class L3: unset; MFR.Part #: MSL0402RGBU1; JLCPCB Part #: C2898980
R16 = PMR01ZZPJU10L: RES 0.01 OHM 5% 1/5W 0402; MFR.Part #: PE0402FRF070R01L; Manufacturer: YAGEO; Value: 10 mOhms; ComponentLink1Description: Datasheet; ComponentLink1URL: https://www.rohm.com/datasheet/PMR18EZPFV/pmr-e; ComponentLink2Description: DigiKey Link; ComponentLink2URL: https://www.digikey.com/en/products/detail/rohm-semiconductor/PMR01ZZPJU10L/5218668; JLCPCB Part #: C2089431
R17 = RQ73C1E1K0BTD: RES 1 KOHMS 0.1% 1/16W 0402; MFR.Part #: 0402WGF1001TCE; Manufacturer: UNI-ROYAL(Uniroyal Elec); Value: 1 kOhms; JLCPCB Part #: C11702
R18 = RT0402BRD07180RL: RES SMD 180 OHM 0.1% 1/16W 0402; MFR.Part #: C38941; Manufacturer: UNI-ROYAL(Uniroyal Elec); Value: 180 Ohms; JLCPCB Part #: 0402WGF1800TCE
R19 R24 = RC0402FR-071K1L: RES 1.1K OHM 1% 1/16W 0402; MFR.Part #: 0402WGF1101TCE; Manufacturer: UNI-ROYAL(Uniroyal Elec); Value: 1.1 kOhms; JLCPCB Part #: C25860
R20 = RP73PF1E100KBTD: RES 100K OHM 0.1% 1/10W 0402; MFR.Part #: 0402WGF1003TCE; Manufacturer: UNI-ROYAL(Uniroyal Elec); Value: 100 kOhms; JLCPCB Part #: 0402
R21 = RR0510P-152-D: RES SMD 1.5K OHM 0.5% 1/16W 0402; MFR.Part #: CRCW04021K50FKED; Manufacturer: Vishay Intertech; Value: 1.5 kOhms; JLCPCB Part #: C71622
R22 = RR0510P-152-D: RES SMD 1.5K OHM 0.5% 1/16W 0402; MFR.Part #: 0402WGF1501TCE; Manufacturer: UNI-ROYAL(Uniroyal Elec); Value: 1.5 kOhms; JLCPCB Part #: C25867
R25 = RC0402FR-071K1L: RES 1.1K OHM 1% 1/16W 0402; MFR.Part #: 0402WGF0000TCE; Manufacturer: UNI-ROYAL(Uniroyal Elec); Value: ohm; JLCPCB Part #: C17168
SW2 = MST-12D18G4 SPDT Slide Switch: MFR.Part #: C49023767; Manufacturer: SHOU HAN; JLCPCB Part #: MST-12D18G4 SPDT Slide Switch
U7 = CMP-04911-000008-1: IC BATT FUEL GAUGE LI-ION 12SON; Manufacturer: Texas Instruments; ComponentLink2URL: http://www.ti.com/lit/gpn/bq27441-g1; ComponentLink2Description: Datasheet; MFR.Part #: BQ27441DRZR-G1A; JLCPCB Part #: C473397
U8 = CMP-0321-00236-3: IC LI-ION CHARGE/PWR MGMT 16-QFN; Manufacturer: Texas Instruments; MFR.Part #: BQ24075RGTT; JLCPCB Part #: C2865459

## Sheet mcu.SchDoc
size A3; SheetNumber: 5; SheetTotal: 11
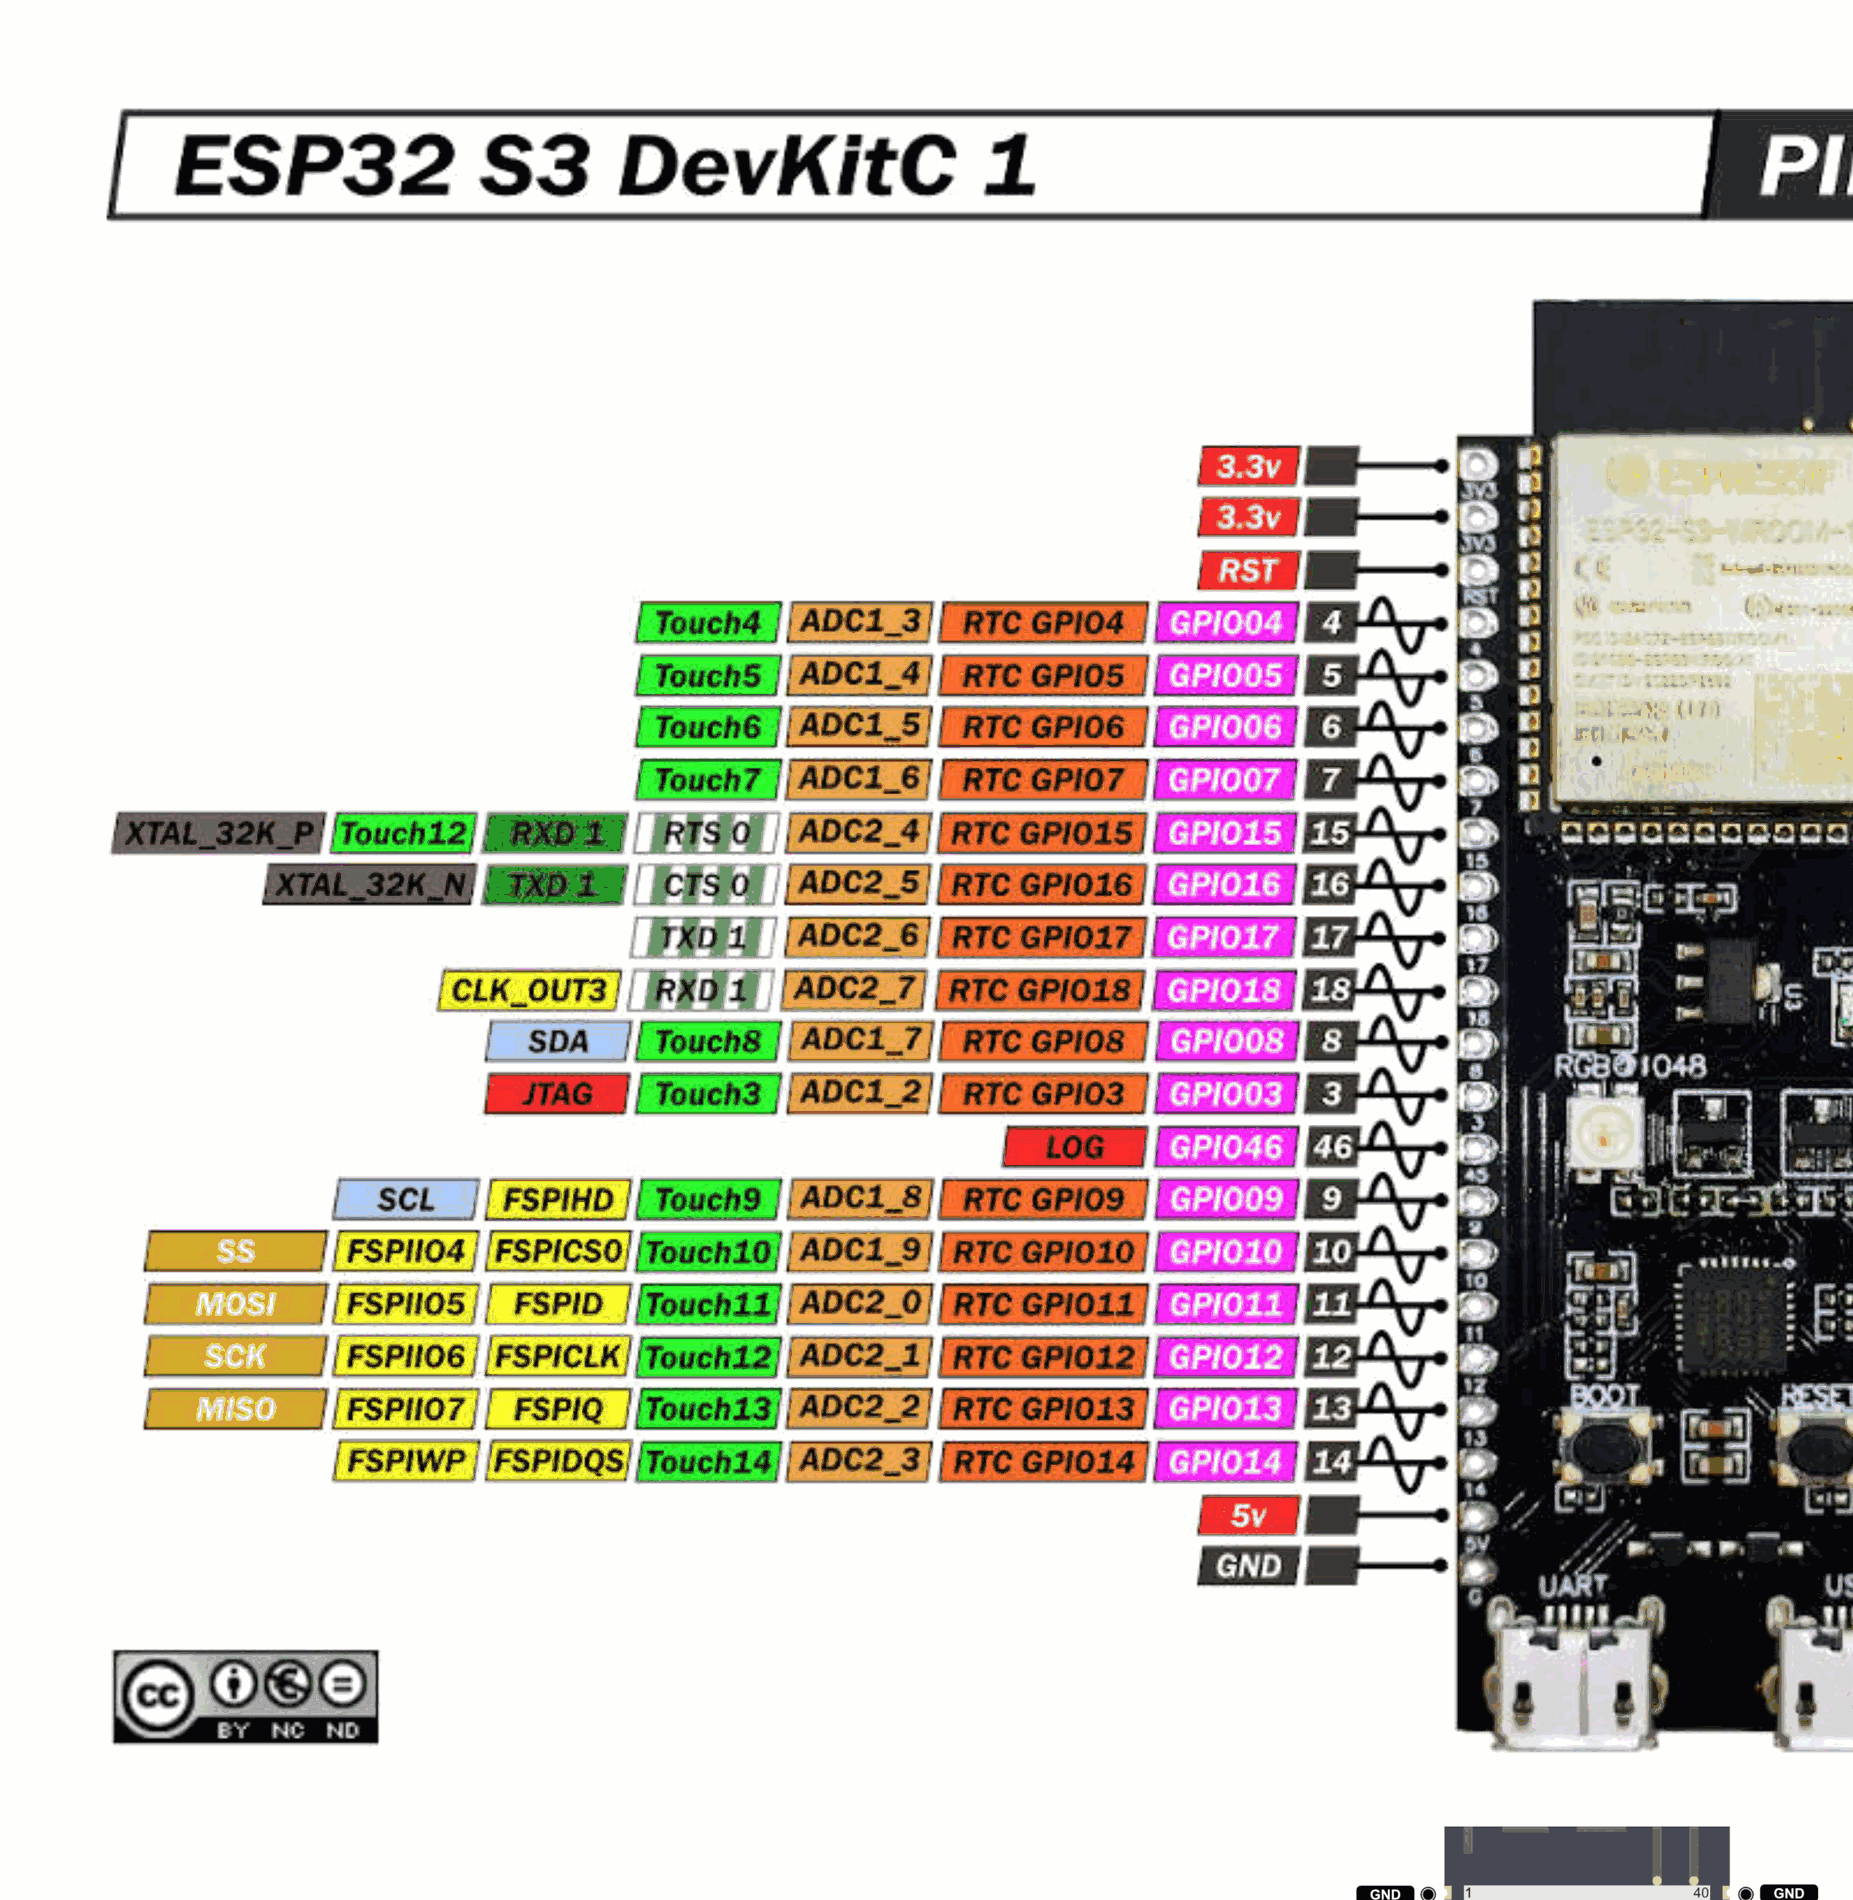
[diagram p9: mcu.SchDoc, top left]
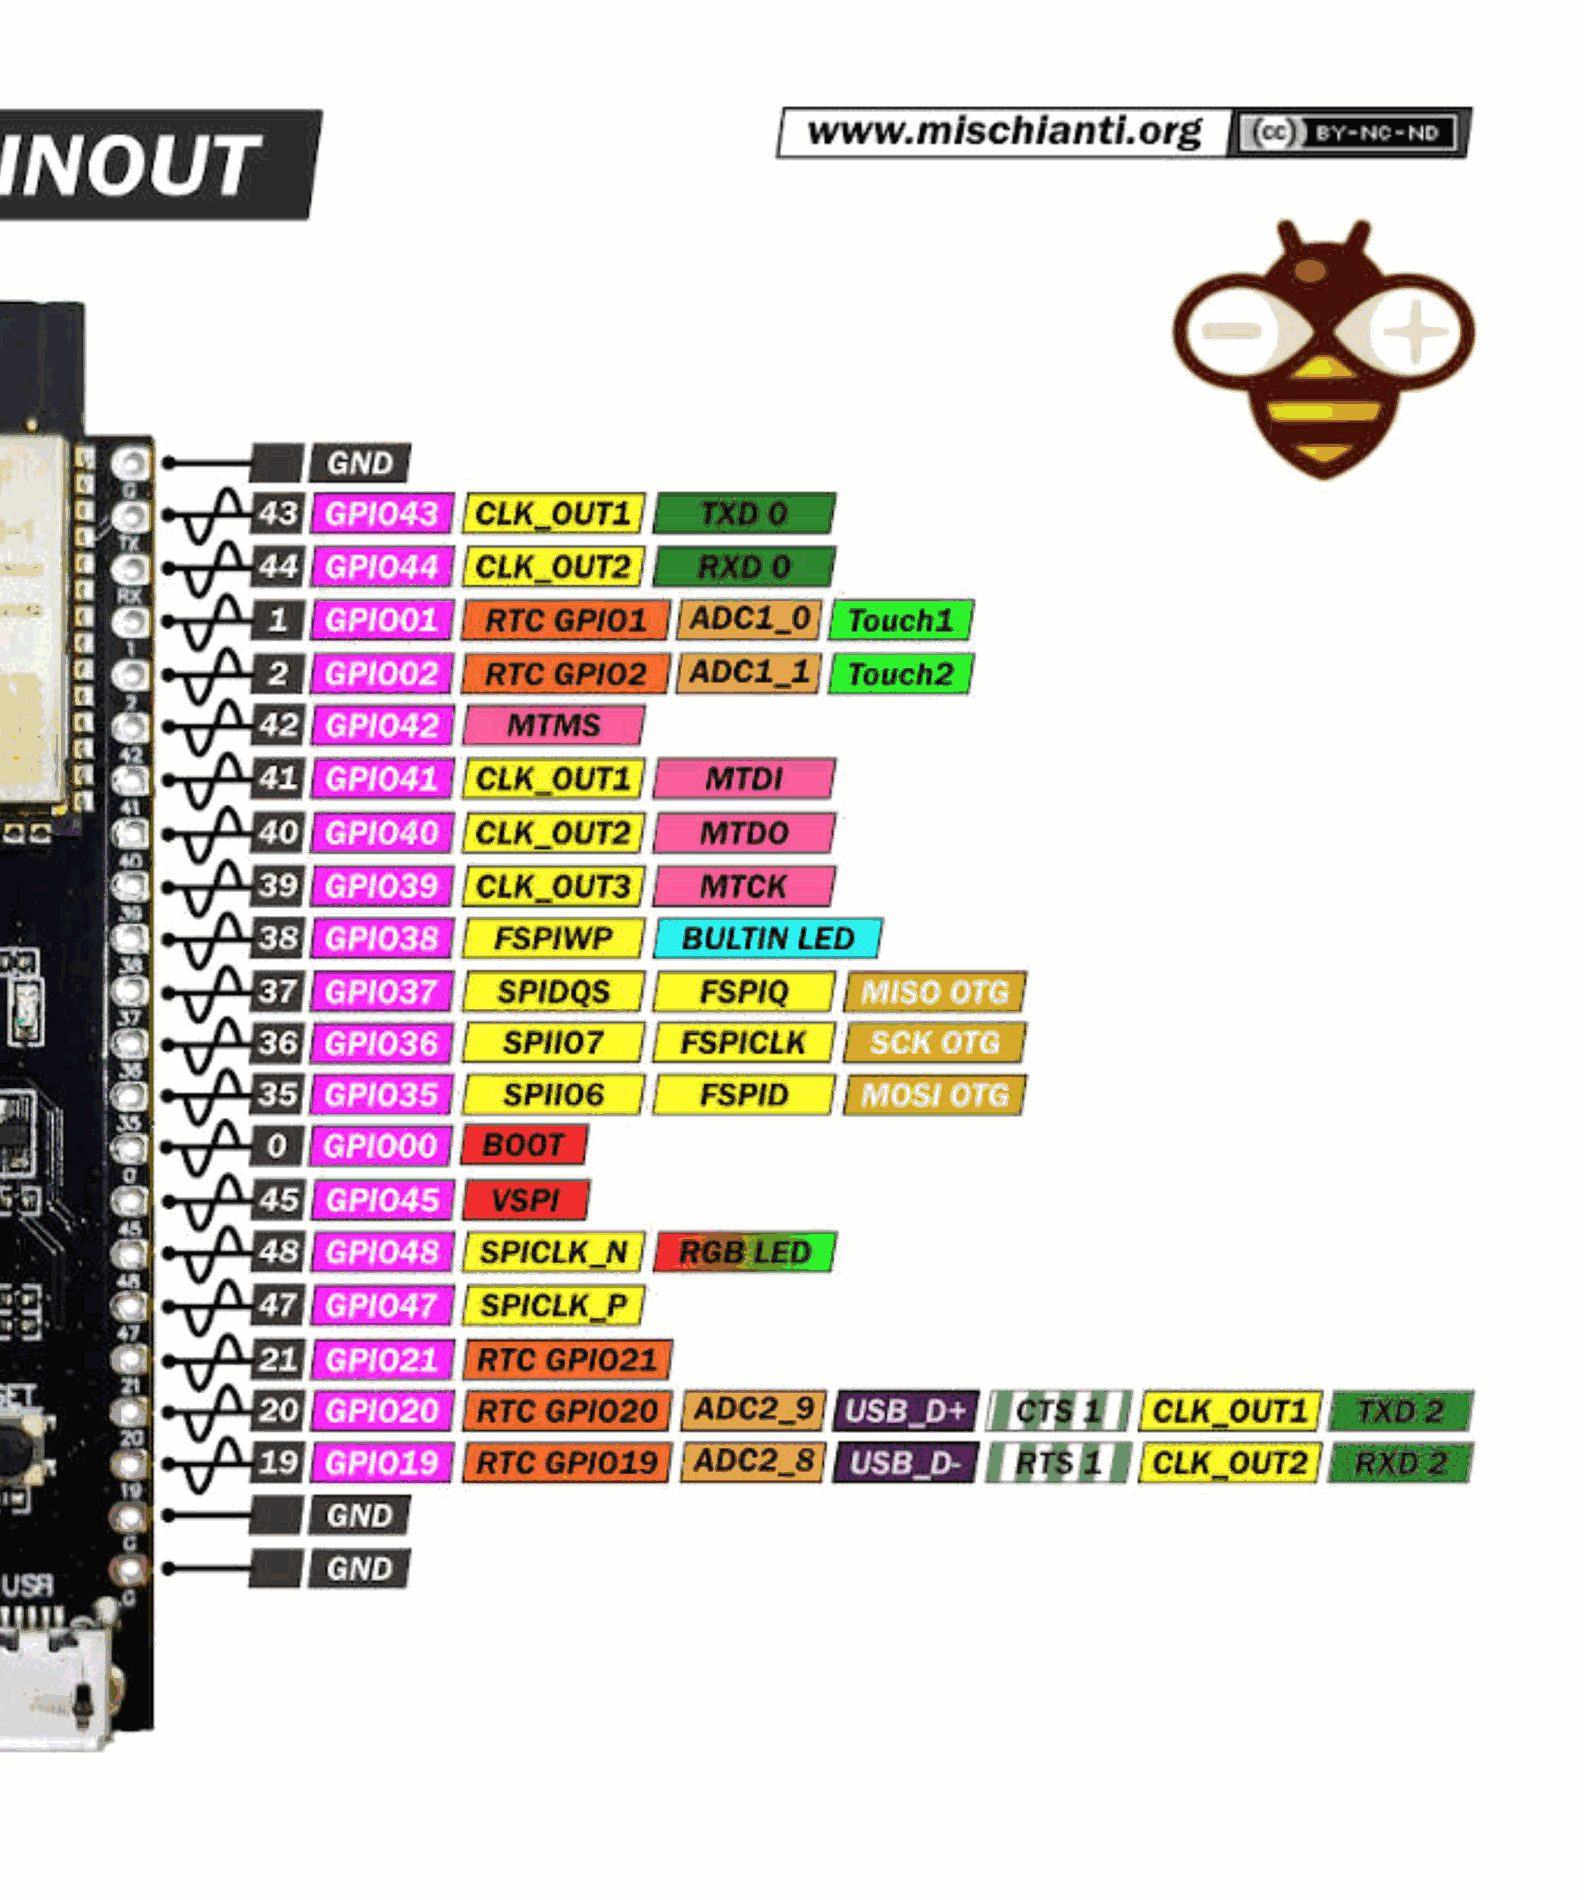
[diagram p10: mcu.SchDoc, top right]
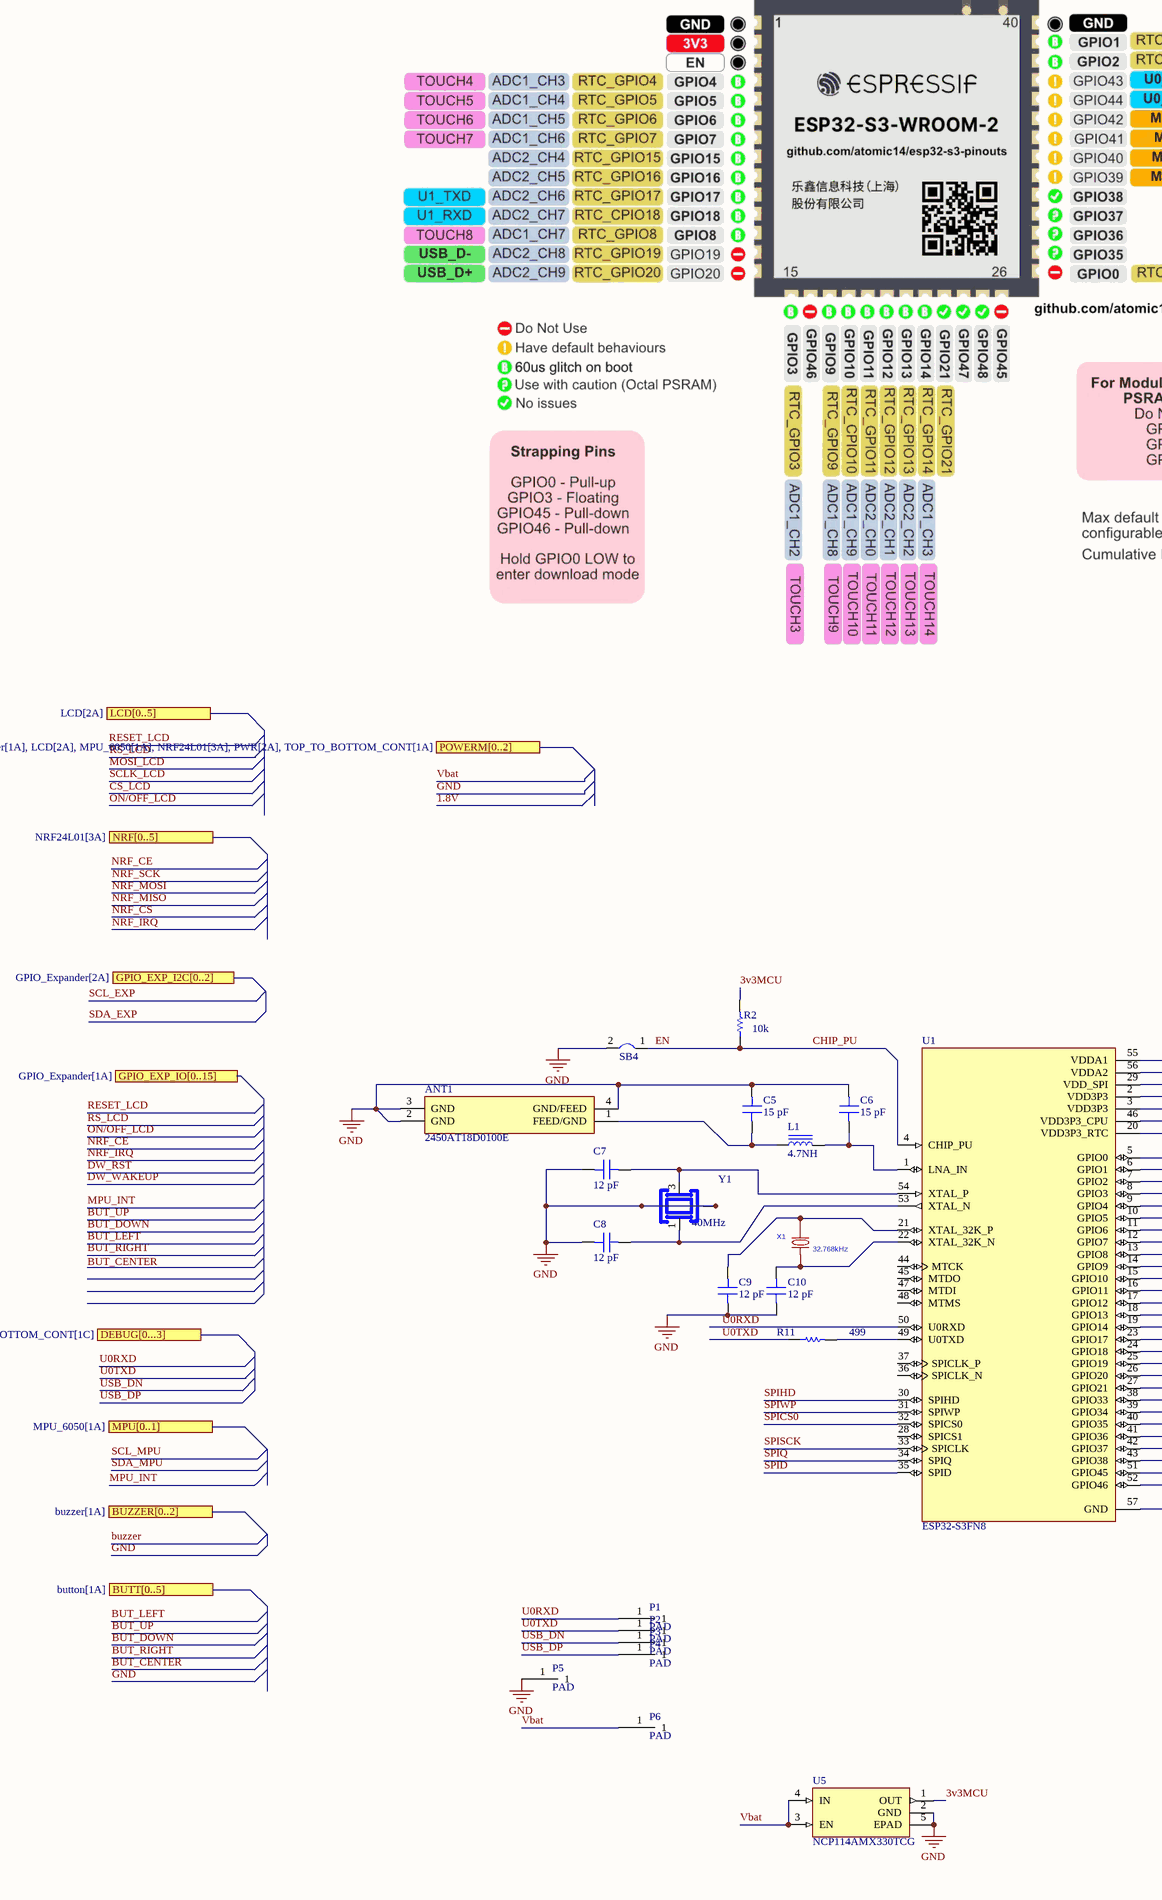
[diagram p11: mcu.SchDoc, bottom left]
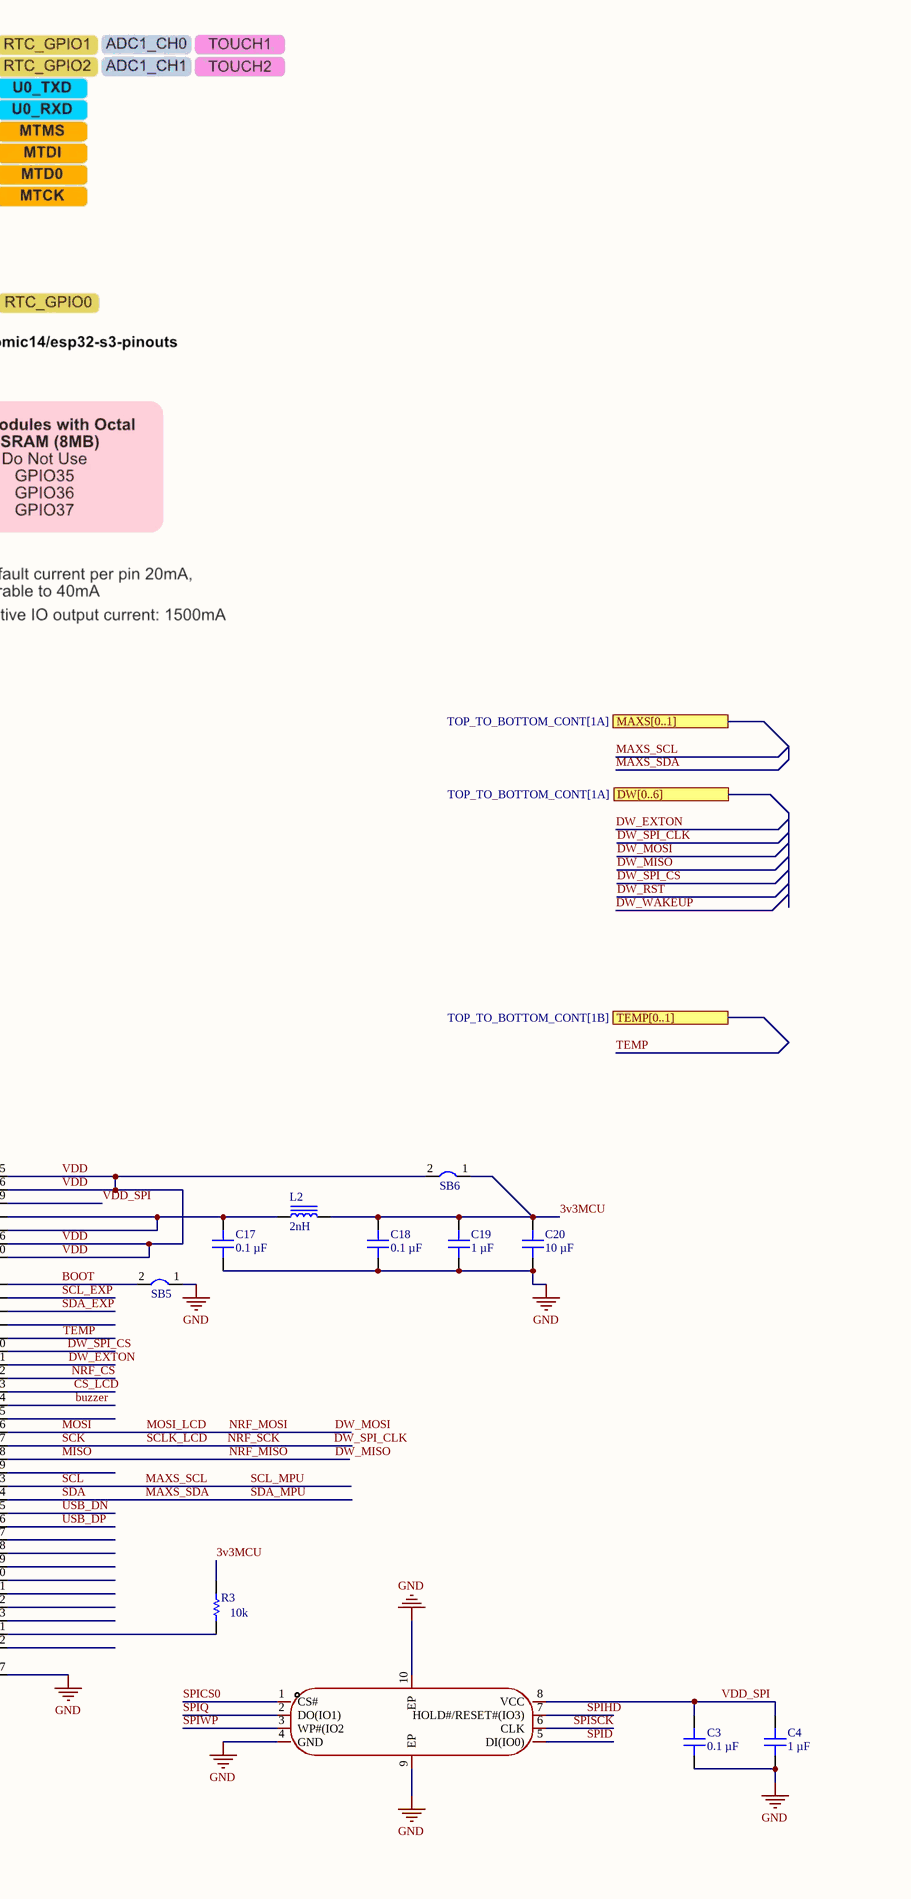
[diagram p12: mcu.SchDoc, bottom right]

### Parts
ANT1  2450AT18D0100E  [FP-2450AT18D0100E-MFG]
C3  Capacitance: 0.1 µF  [CAP 0402_1005]
C4  Capacitance: 1 µF  [CAP 0402_1005]
C5  Capacitance: 15 pF  [CAP 0402_1005]
C6  Capacitance: 15 pF  [CAP 0402_1005]
C7  Capacitance: 12 pF  [CAP 0402_1005]
C8  Capacitance: 12 pF  [CAP 0402_1005]
C9  Capacitance: 12 pF  [CAP 0402_1005]
C10  Capacitance: 12 pF  [CAP 0402_1005]
C17  Capacitance: 0.1 µF  [CAP 0402_1005]
C18  Capacitance: 0.1 µF  [CAP 0402_1005]
C19  Capacitance: 1 µF  [CAP 0402_1005]
C20  Capacitance: 10 µF  [CAP 0402_1005]
L1  4.7NH  [Murata LQG15 0402]
L2  2nH  [IND 0402_1005]
P1  PAD  [PCBComponent_1]
P2  PAD  [PCBComponent_1]
P3  PAD  [PCBComponent_1]
P4  PAD  [PCBComponent_1]
P5  PAD  [PCBComponent_1]
P6  PAD  [PCBComponent_1]
R2  resistance: 10k  [RESC1005X40X25LL05T10]  (hidden comment: 0402WGF1002TCE)
R3  resistance: 10k  [RESC1005X40X25LL05T10]  (hidden comment: 0402WGF1002TCE)
R11  resistance: 499  [RESC1005X40X20LL05T10]  (hidden comment: TNPW0402499RBEED)
SB4  Jumper  [Jumper]  (value not drawn)
SB5  Jumper  [Jumper]  (value not drawn)
SB6  Jumper  [Jumper]  (value not drawn)
U1  ESP32-S3FN8  [QFN40P700X700X90-57N]
U3  W25Q64JWUUIQ  [USON-8_L4.0-W3.0-P0.80-BL_WINBOND_UU]  (value not drawn)
U5  NCP114AMX330TCG  [REG_NCP114AMX330TCG]
X1  32.768kHz  [FC-135R_L3.2-W1.5]
Y1  value 40MHz  [C5261125]  (hidden comment: L225S400L11L)

### Ports
BUTT[0..5] (see button[1A]), BUZZER[0..2] (see buzzer[1A]), DEBUG[0...3] (see TOP_TO_BOTTOM_CONT[1C]), DW[0..6] (see TOP_TO_BOTTOM_CONT[1A]), GPIO_EXP_I2C[0..2] (see GPIO_Expander[2A]), GPIO_EXP_IO[0..15] (see GPIO_Expander[1A]), LCD[0..5] (see LCD[2A]), MAXS[0..1] (see TOP_TO_BOTTOM_CONT[1A]), MPU[0..1] (see MPU_6050[1A]), NRF[0..5] (see NRF24L01[3A]), POWERM[0..2] (see GPIO_Expander[1A], LCD[2A], MPU_6050[1A], NRF24L01[3A], PWR[2A], TOP_TO_BOTTOM_CONT[1A]), TEMP[0..1] (see TOP_TO_BOTTOM_CONT[1B])

### Nets
GND: ANT1.2(GND) ANT1.3(GND) ANT1.4(GND/FEED) C3.1 C4.1 C5.2 C6.2 C7.1 C8.1 C9.2 C10.2 C17.1 C18.1 C19.1 C20.1 P5.1 SB4.2 SB5.1 U1.57(GND) U3.4(GND) U3.9(EP) U3.10(EP) U5.2(GND) U5.5(EPAD) Y1.2(GND) Y1.4(GND)
3v3mCU: C18.2 C19.2 C20.2 L2.2 R2.2 R3.2 SB6.1 U5.1(OUT)
BOOT: SB5.2 U1.5(GPIO0)
buzzer: U1.14(GPIO9)
CHIP_PU: R2.1 SB4.1 U1.4(CHIP_PU)  [also labelled EN]
CS_LCD: U1.13(GPIO8)
DW_EXTON: U1.11(GPIO6)
DW_MISO: U1.18(GPIO13)  [also labelled MISO, NRF_MISO]
DW_MOSI: U1.16(GPIO11)  [also labelled MOSI, MOSI_LCD, NRF_MOSI]
DW_SPI_CLK: U1.17(GPIO12)  [also labelled NRF_SCK, SCK, SCLK_LCD]
DW_SPI_CS: U1.10(GPIO5)
MAXS_SCL: U1.23(GPIO17)  [also labelled SCL, SCL_MPU]
MAXS_SDA: U1.24(GPIO18)  [also labelled SDA, SDA_MPU]
NRF_CS: U1.12(GPIO7)
SCL_EXP: U1.6(GPIO1)
SDA_EXP: U1.7(GPIO2)
SPICS0: U1.32(SPICS0) U3.1(CS#)
SPID: U1.35(SPID) U3.5(DI(IO0))
SPIHD: U1.30(SPIHD) U3.7(HOLD#/RESET#(IO3))
SPIQ: U1.34(SPIQ) U3.2(DO(IO1))
SPISCK: U1.33(SPICLK) U3.6(CLK)
SPIWP: U1.31(SPIWP) U3.3(WP#(IO2)
TEMP: U1.9(GPIO4)
U0RXD: P1.1 U1.50(U0RXD)
U0TXD: P2.1 R11.1
USB_DN: P3.1 U1.25(GPIO19)
USB_DP: P4.1 U1.26(GPIO20)
Vbat: P6.1 U5.3(EN) U5.4(IN)
VDD: SB6.2 U1.20(VDD3P3_RTC) U1.46(VDD3P3_CPU) U1.55(VDDA1) U1.56(VDDA2)
VDD_SPI: C3.2 C4.2 U1.29(VDD_SPI) U3.8(VCC)
NetANT1_1: ANT1.1(FEED/GND) C5.1 L1.1
NetC6_1: C6.1 L1.2 U1.1(LNA_IN)
NetC7_2: C7.2 U1.54(XTAL_P) Y1.3(OUT/IN)
NetC8_2: C8.2 U1.53(XTAL_N) Y1.1(IN/OUT)
NetC9_1: C9.1 U1.21(XTAL_32K_P) X1.2
NetC10_1: C10.1 U1.22(XTAL_32K_N) X1.1
NetC17_2: C17.2 L2.1 U1.2(VDD3P3) U1.3(VDD3P3)
NetR3_1: R3.1 U1.51(GPIO45)
NetR11_2: R11.2 U1.49(U0TXD)

Not connected (* = marked no-connect by the designer): U1 8(GPIO3) 15(GPIO10) 19(GPIO14) 27(GPIO21) 28(SPICS1) 36(SPICLK_N) 37(SPICLK_P) 38(GPIO33) 39(GPIO34) 40(GPIO35) 41(GPIO36) 42(GPIO37) 43(GPIO38) 44(MTCK) 45(MTDO) 47(MTDI) 48(MTMS) 52(GPIO46)

### Notes on the sheet
- Labels drawn without touching a wire or pin: BUT_CENTER

### Library data of the parts
ANT1 = CMP-2000-05543-2: RF ANT 2.4GHZ CHIP SOLDER SMD; Manufacturer: Johanson Dielectrics; JLCPCB Part #: C2917718; MFR.Part #: 2450AT18D0100E
C3 C17 C18 = 0402B104J160CT: as C27 on sheet MPU_6050; JLCPCB Part #: C60474
  C3: Device Package: 0402 (1005 Metric); Size / Dimension: 0.039" L x 0.020" W (1.00mm x 0.50mm)
C4 = 0402DD105KAT2A: 10V 1uF X5R ±10% 0402 Multilayer Ceramic Capacitors MLCC - SMD/SMT ROHS; Part Number: CL05A105KP5NNNC; Manufacturer: Samsung Electro-Mechanics; Device Package: 0402 (1005 Metric); Size / Dimension: 0.039" L x 0.020" W (1.00mm x 0.50mm); MFR.Part #: CL05A105KP5NNNC; JLCPCB Part #: C14445
C5 C6 = 201R07S150GV4T: CAP CER 15PF 200V C0G/NP0 0402; Manufacturer: FH (Guangdong Fenghua Advanced Tech); MFR.Part #: 0402CG150J500NT; JLCPCB Part #: C1548
  C6: Applications: RF, Microwave, High Frequency
C7-C9 = 201R07S120GV4T: CAP CER 12PF 200V C0G/NP0 0402; Manufacturer: FH (Guangdong Fenghua Advanced Tech); MFR.Part #: 0402CG120J500NT; JLCPCB Part #: C1547
C10 = 201R07S120GV4T: CAP CER 12PF 200V C0G/NP0 0402; Part Number: 0402CG120J500NT; Manufacturer: FH (Guangdong Fenghua Advanced Tech); Device Package: 0402 (1005 Metric); Mounting Type: Surface Mount, MLCC; Size / Dimension: 0.040" L x 0.020" W (1.02mm x 0.51mm); MFR.Part #: 0402CG120J500NT; JLCPCB Part #: C1547
C19 = 0402DD105KAT2A: as C26 on sheet MPU_6050; JLCPCB Part #: C14445
C20 = 0402DD105KAT2A: as C28 on sheet MPU_6050; JLCPCB Part #: C15525
L1 = LQG15HN4N7B02D: 200mΩ 300mA 4.7nH 4GHz 8@100MHz 0402 Inductors (SMD) ROHS; Manufacturer: Sunlord; MFR.Part #: SDCL1005C4N7STDF; value: 4.7NH; JLCPCB Part #: C13595
L2 = HLC022R0BTTR: FIXED IND 2NH 596MA 180 MOHM SMD; Manufacturer: AVX Corporation; MFR.Part #: W25Q64JWUUIQ; DC Resistance (DCR): 180mOhm Max; Frequency - Self Resonant: 17GHz; Inductance Frequency - Test: 450MHz; Material - Core: Non-Magnetic; Q @ Freq: 26 @ 450MHz; Shielding: Unshielded; Tolerance: ±0.1nH; Type: Multilayer; Part Number: HLC022R0BTTR; ComponentLink1Description: Datasheet; ComponentLink1URL: //media.digikey.com/pdf/Data%20Sheets/AVX%20PDFs/MLO%20High%20Current%20Inductors.pdf; ComponentLink2Description: DigiKey Link; ComponentLink2URL: http://digikey.com/product-detail/en/avx-corporation/HLC022R0BTTR/478-7195-1-ND/3528423; Current Rating (Amps): 596mA; Device Package: 0402 (1005 Metric); Height - Seated (Max): 0.018" (0.45mm); Inductance: 2nH; LastUpdated: 9/2/2020 1:24:25 AM; Lifecycle Status: Active; Minimum Order: 1; Mounting Type: Surface Mount; Operating Temperature: -55°C ~ 125°C; Package / Case: 0402 (1005 Metric); Packaging: TapeAndReel; PartId: 1747; Part Status: Active; Price: 0.14; Series: MLO™; Size / Dimension: 0.039" L x 0.023" W (1.00mm x 0.58mm); Supplier 1: DigiKey; Supplier Part Number 1: 478-7195-1-ND; Supplier Device Package: 0402 (1005 Metric); Value: 2nH; JLCPCB Part #: C6604692
R2 R3 = CMP-2002-03043-1: Manufacturer: UNI-ROYAL(Uniroyal Elec); JLCPCB Part #: C25744; MFR.Part #: 0402WGF1002TCE
R11 = CMP-2002-01693-1: Manufacturer: YAGEO; MFR.Part #: RC0402FR-07499RL; JLCPCB Part #: C137970
U1 = ESP32-S3FN8: Espressif Systems [ENGINEERING SAMPLES]SMD IC , Dual-Core MCU, Wi-Fi 2.4G & BLE 5.0 combo, 8 MB Octal SPI PSRAM, QFN 56-pin, 7*7 mm; Manufacturer: Espressif Systems; MFR.Part #: ESP32-S3FN8; JLCPCB Part #: C2913196
U3 = W25Q64JWUUIQ: Manufacturer: Winbond Elec; JLCPCB Part #: C6604692; MFR.Part #: W25Q64JWUUIQ
U5 = NCP114AMX330TCG: Linear Voltage Regulator IC Positive Fixed 1 Output 300mA 4-UDFN (1.0x1.0); Manufacturer: onsemi; MFR.Part #: C133056; JLCPCB Part #: NCP114AMX330TCG
X1 = Q13FC13500004_C32346: Manufacturer: Seiko Epson; Value: 32.768kHz; MFR.Part #: Q13FC13500004; JLCPCB Part #: C32346
Y1 = L225S400L11L: -40℃~+85℃ 12pF 40MHz Crystal Oscillator ±10ppm SMD2520-4P Crystals ROHS; Manufacturer: Lucki; JLCPCB Part #: C5261125; MFR.Part #: L225S400L11L

## Sheet TOP_TO_BOTTOM_CONT.SchDoc
size A; SheetNumber: 7; SheetTotal: 11
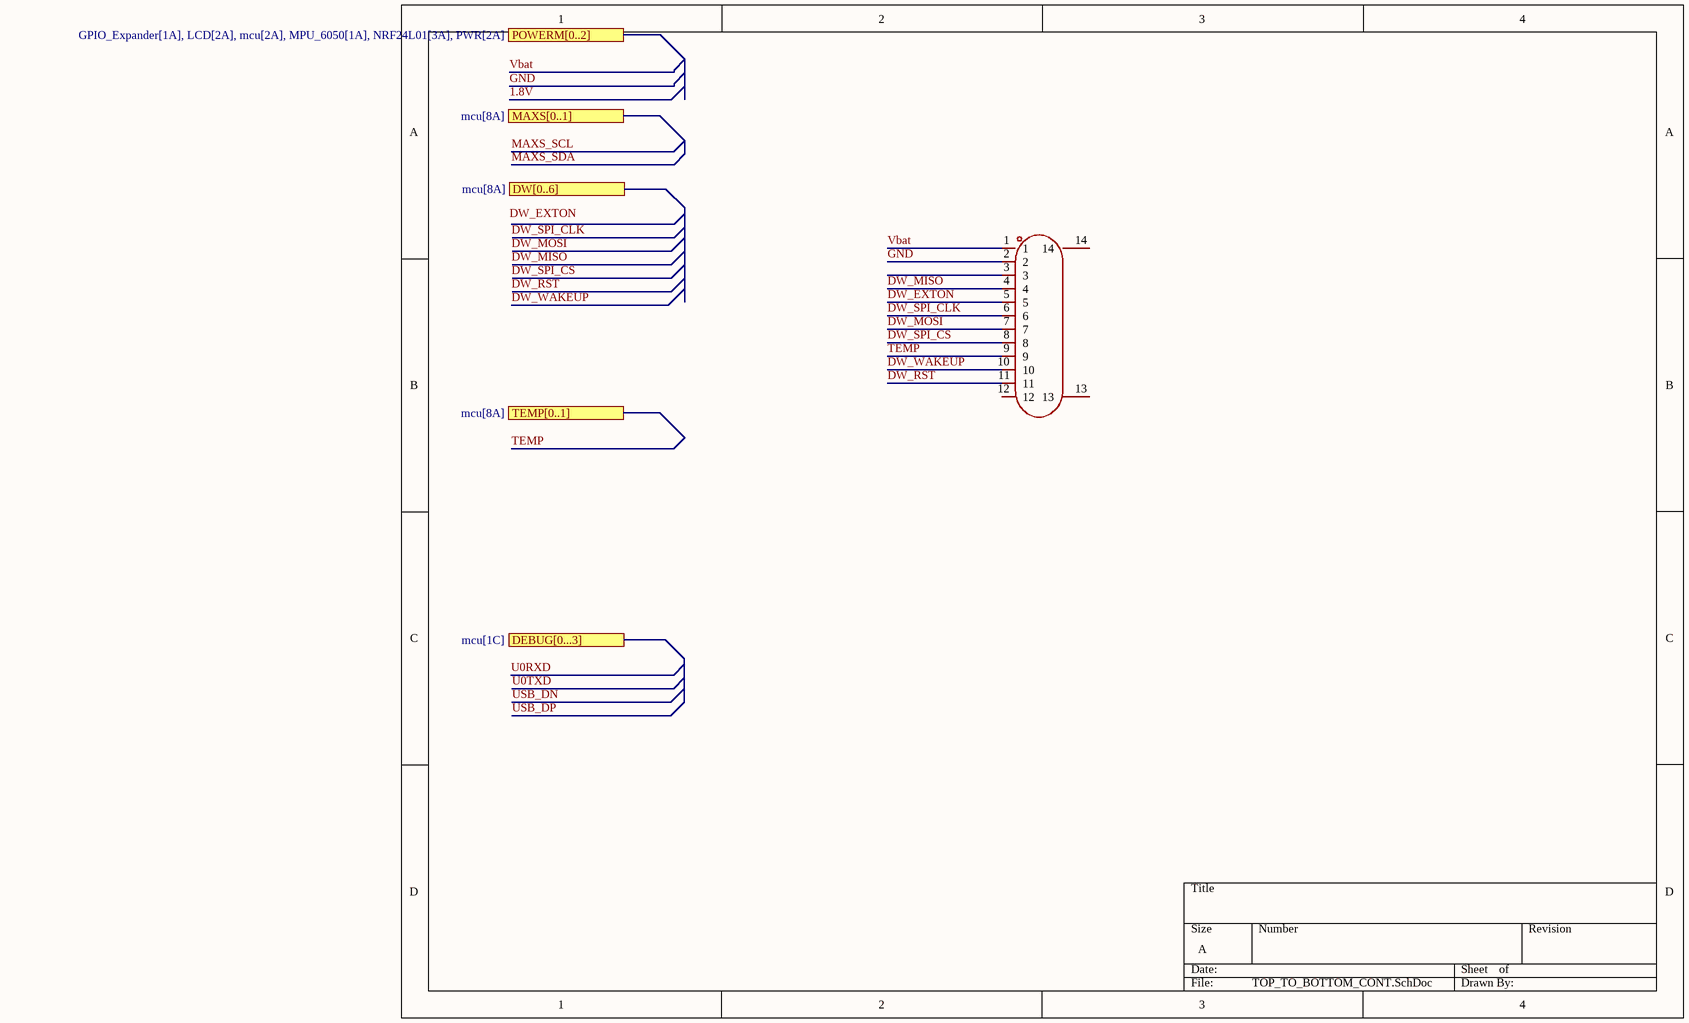
[diagram p13: TOP_TO_BOTTOM_CONT.SchDoc]

### Parts
FPC2  FH12-12S-0.5SH(55)  [FPC-SMD_FH12-12S-0.5SH-55]  (value not drawn)

### Ports
DEBUG[0...3] (see mcu[1C]), DW[0..6] (see mcu[8A]), MAXS[0..1] (see mcu[8A]), POWERM[0..2] (see GPIO_Expander[1A], LCD[2A], mcu[2A], MPU_6050[1A], NRF24L01[3A], PWR[2A]), TEMP[0..1] (see mcu[8A])

### Nets
GND: FPC2.2
DW_EXTON: FPC2.5
DW_MISO: FPC2.4
DW_MOSI: FPC2.7
DW_RST: FPC2.11
DW_SPI_CLK: FPC2.6
DW_SPI_CS: FPC2.8
DW_WAKEUP: FPC2.10
TEMP: FPC2.9
Vbat: FPC2.1

Not connected (* = marked no-connect by the designer): FPC2 3 12 13 14

### Notes on the sheet
- Labels drawn without touching a wire or pin: DW_EXTON, DW_MISO, DW_MOSI, DW_RST, DW_SPI_CLK, DW_SPI_CS

### Library data of the parts
FPC2 = FH12-12S-0.5SH(55): Manufacturer: HRS(Hirose); MFR.Part #: FH12-12S-0.5SH(55); JLCPCB Part #: C88360

## Nets that join several sheets
GND: NRF24L01 (14 pins), LCD (5 pins), button (SW1.5), MPU_6050 (10 pins), buzzer (SB7.1), GPIO_Expander (7 pins), PWR (12 pins), mcu (26 pins), TOP_TO_BOTTOM_CONT (FPC2.2)
3v3mCU: LCD (C1.2 C2.2 FPC1.7), mcu (8 pins)
BUT_CENTER: button (SW1.2), GPIO_Expander (U2.1)
BUT_DOWN: button (SW1.4), GPIO_Expander (U2.26)
BUT_LEFT: button (SW1.1), GPIO_Expander (U2.27)
BUT_RIGHT: button (SW1.6), GPIO_Expander (U2.28)
BUT_UP: button (SW1.3), GPIO_Expander (U2.25)
buzzer: buzzer (SB7.2), mcu (U1.14)
CS_LCD: LCD (FPC1.8), mcu (U1.13)
DW_EXTON: mcu (U1.11), TOP_TO_BOTTOM_CONT (FPC2.5)
DW_MISO: NRF24L01 (U4.5), mcu (U1.18), TOP_TO_BOTTOM_CONT (FPC2.4)
DW_MOSI: NRF24L01 (U4.4), LCD (FPC1.5), mcu (U1.16), TOP_TO_BOTTOM_CONT (FPC2.7)
DW_RST: GPIO_Expander (U2.22), TOP_TO_BOTTOM_CONT (FPC2.11)
DW_SPI_CLK: NRF24L01 (U4.3), LCD (FPC1.6), mcu (U1.17), TOP_TO_BOTTOM_CONT (FPC2.6)
DW_SPI_CS: mcu (U1.10), TOP_TO_BOTTOM_CONT (FPC2.8)
DW_WAKEUP: GPIO_Expander (U2.23), TOP_TO_BOTTOM_CONT (FPC2.10)
MAXS_SCL: MPU_6050 (R14.1 U6.23), PWR (U7.2), mcu (U1.23)
MAXS_SDA: MPU_6050 (R15.1 U6.24), PWR (U7.1), mcu (U1.24)
MPU_INT: MPU_6050 (U6.12), GPIO_Expander (U2.24)
NRF_CE: NRF24L01 (U4.1), GPIO_Expander (U2.20)
NRF_CS: NRF24L01 (U4.2), mcu (U1.12)
NRF_IRQ: NRF24L01 (U4.6), GPIO_Expander (U2.21)
ON/OFF_LCD: LCD (FPC1.1), GPIO_Expander (U2.19)
RESET_LCD: LCD (FPC1.3), GPIO_Expander (U2.17)
RS_LCD: LCD (FPC1.4), GPIO_Expander (U2.18)
SCL_EXP: GPIO_Expander (R4.1 U2.8), mcu (U1.6)
SDA_EXP: GPIO_Expander (R5.1 U2.9), mcu (U1.7)
TEMP: mcu (U1.9), TOP_TO_BOTTOM_CONT (FPC2.9)
Vbat: NRF24L01 (U9.3 U9.4), MPU_6050 (U11.3 U11.4), GPIO_Expander (U10.3 U10.4), PWR (R22.1 SW2.3), mcu (P6.1 U5.3 U5.4), TOP_TO_BOTTOM_CONT (FPC2.1)

## Assembly variants
SW_V1.0: not fitted P1 P2 P3 P4 P5 P6 SB1 SB2 SB3 SB4 SB5 SB6 SB7 SB8 SB9